# EasyEDA schematic 1-Schematic_NotKia 168x.json

## Sheets
1 Core: TITLE: Notkia Core; REV: 2.0; Date: 2022-04-26; Sheet: 1/12; Drawn By: re1mu; Company: SudoMaker
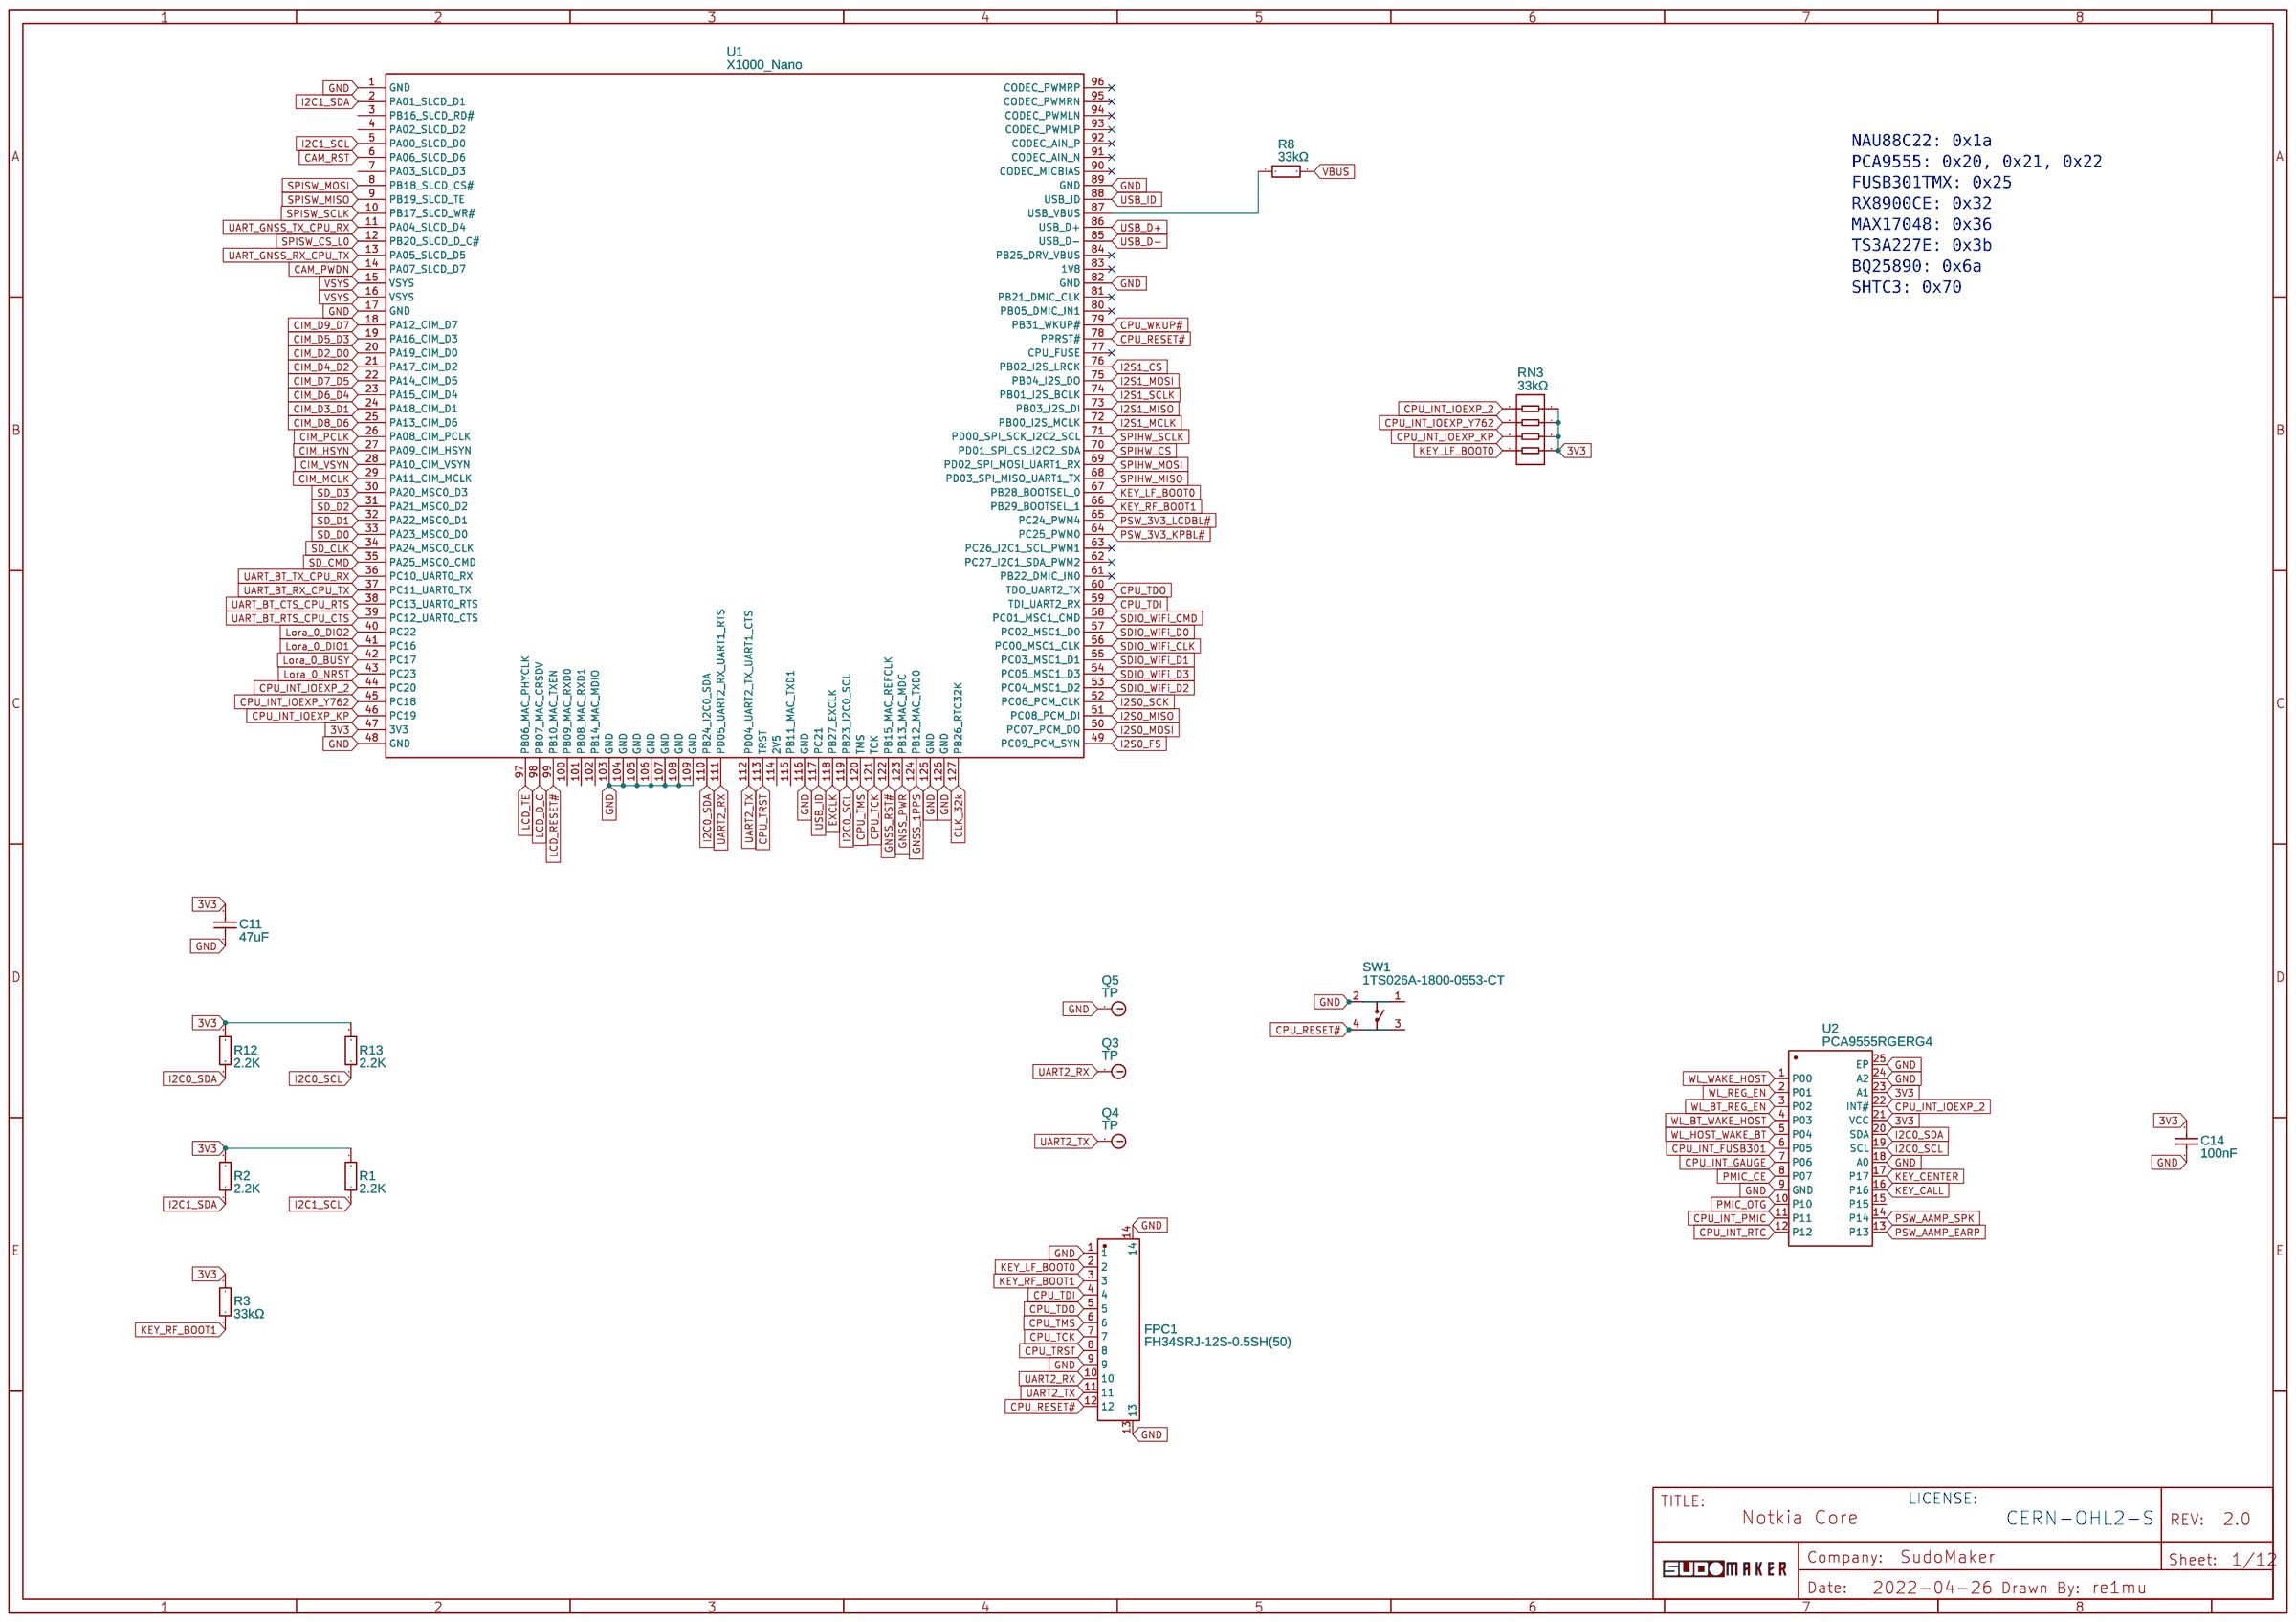
[diagram p0: Core]
2 Camera: TITLE: Notkia Camera; Date: 2022-05-16; Sheet: 2/12
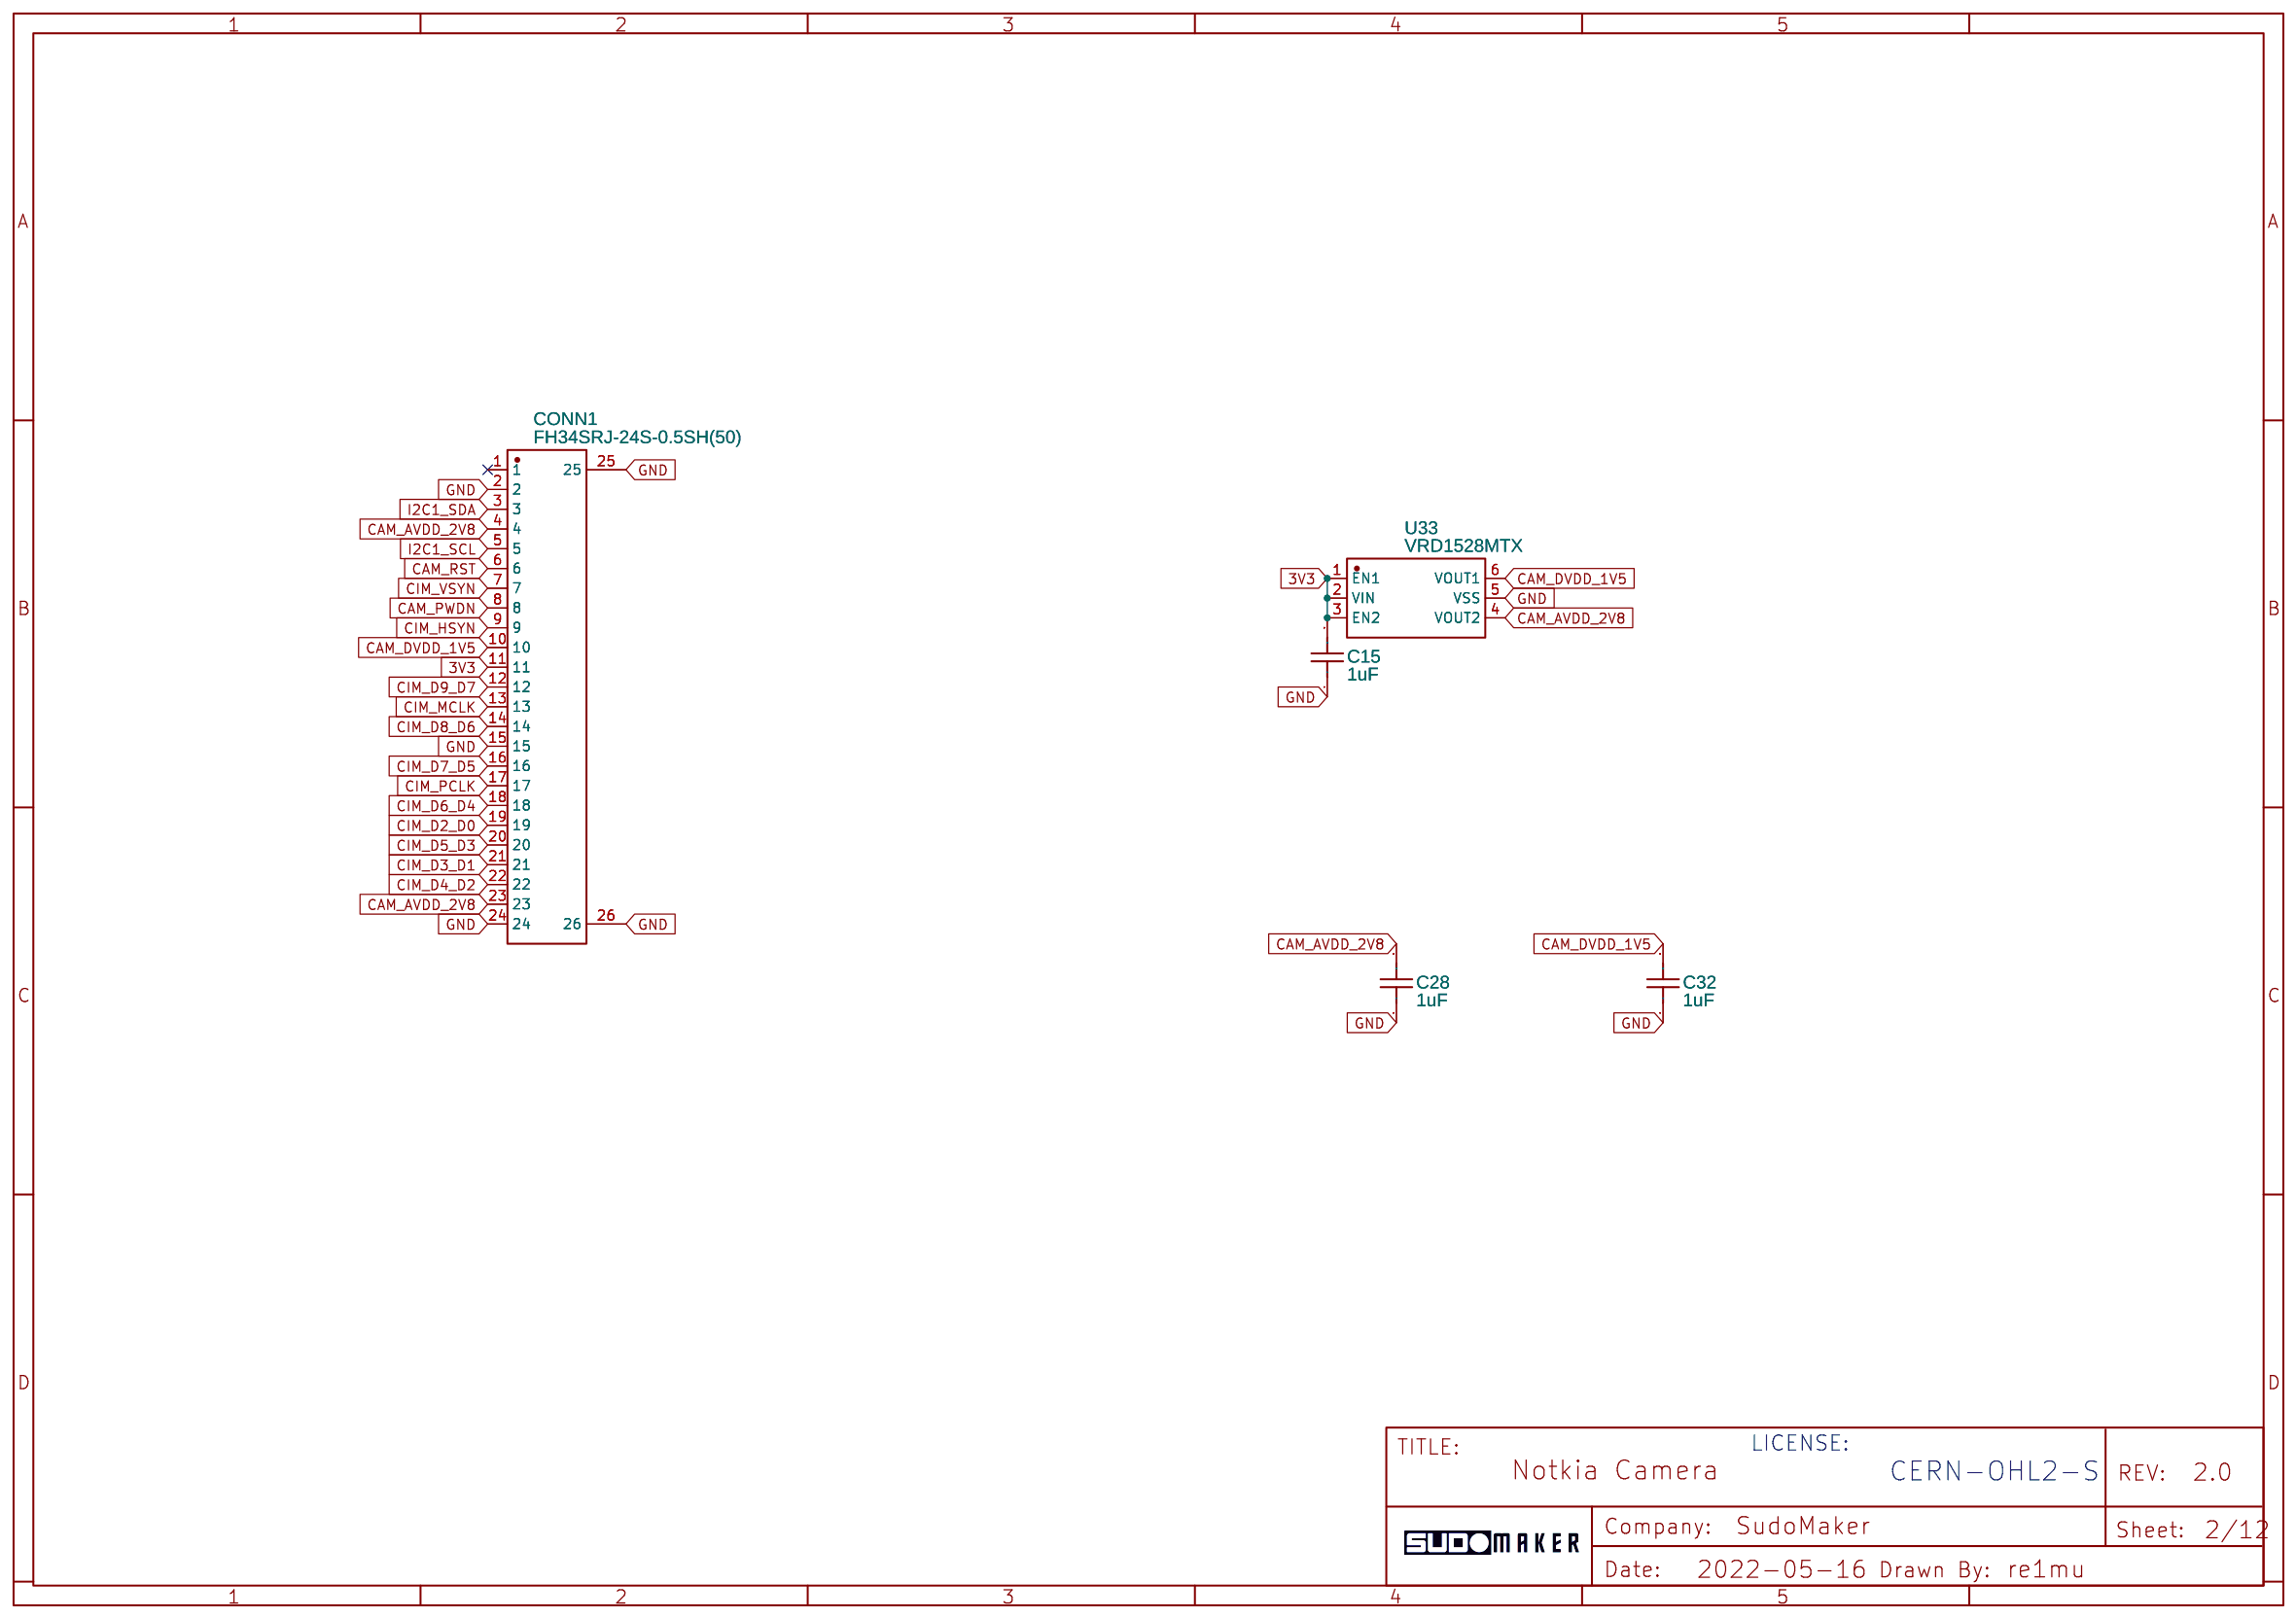
[diagram p1: Camera]
3 USB: TITLE: Notkia USB; Sheet: 3/12
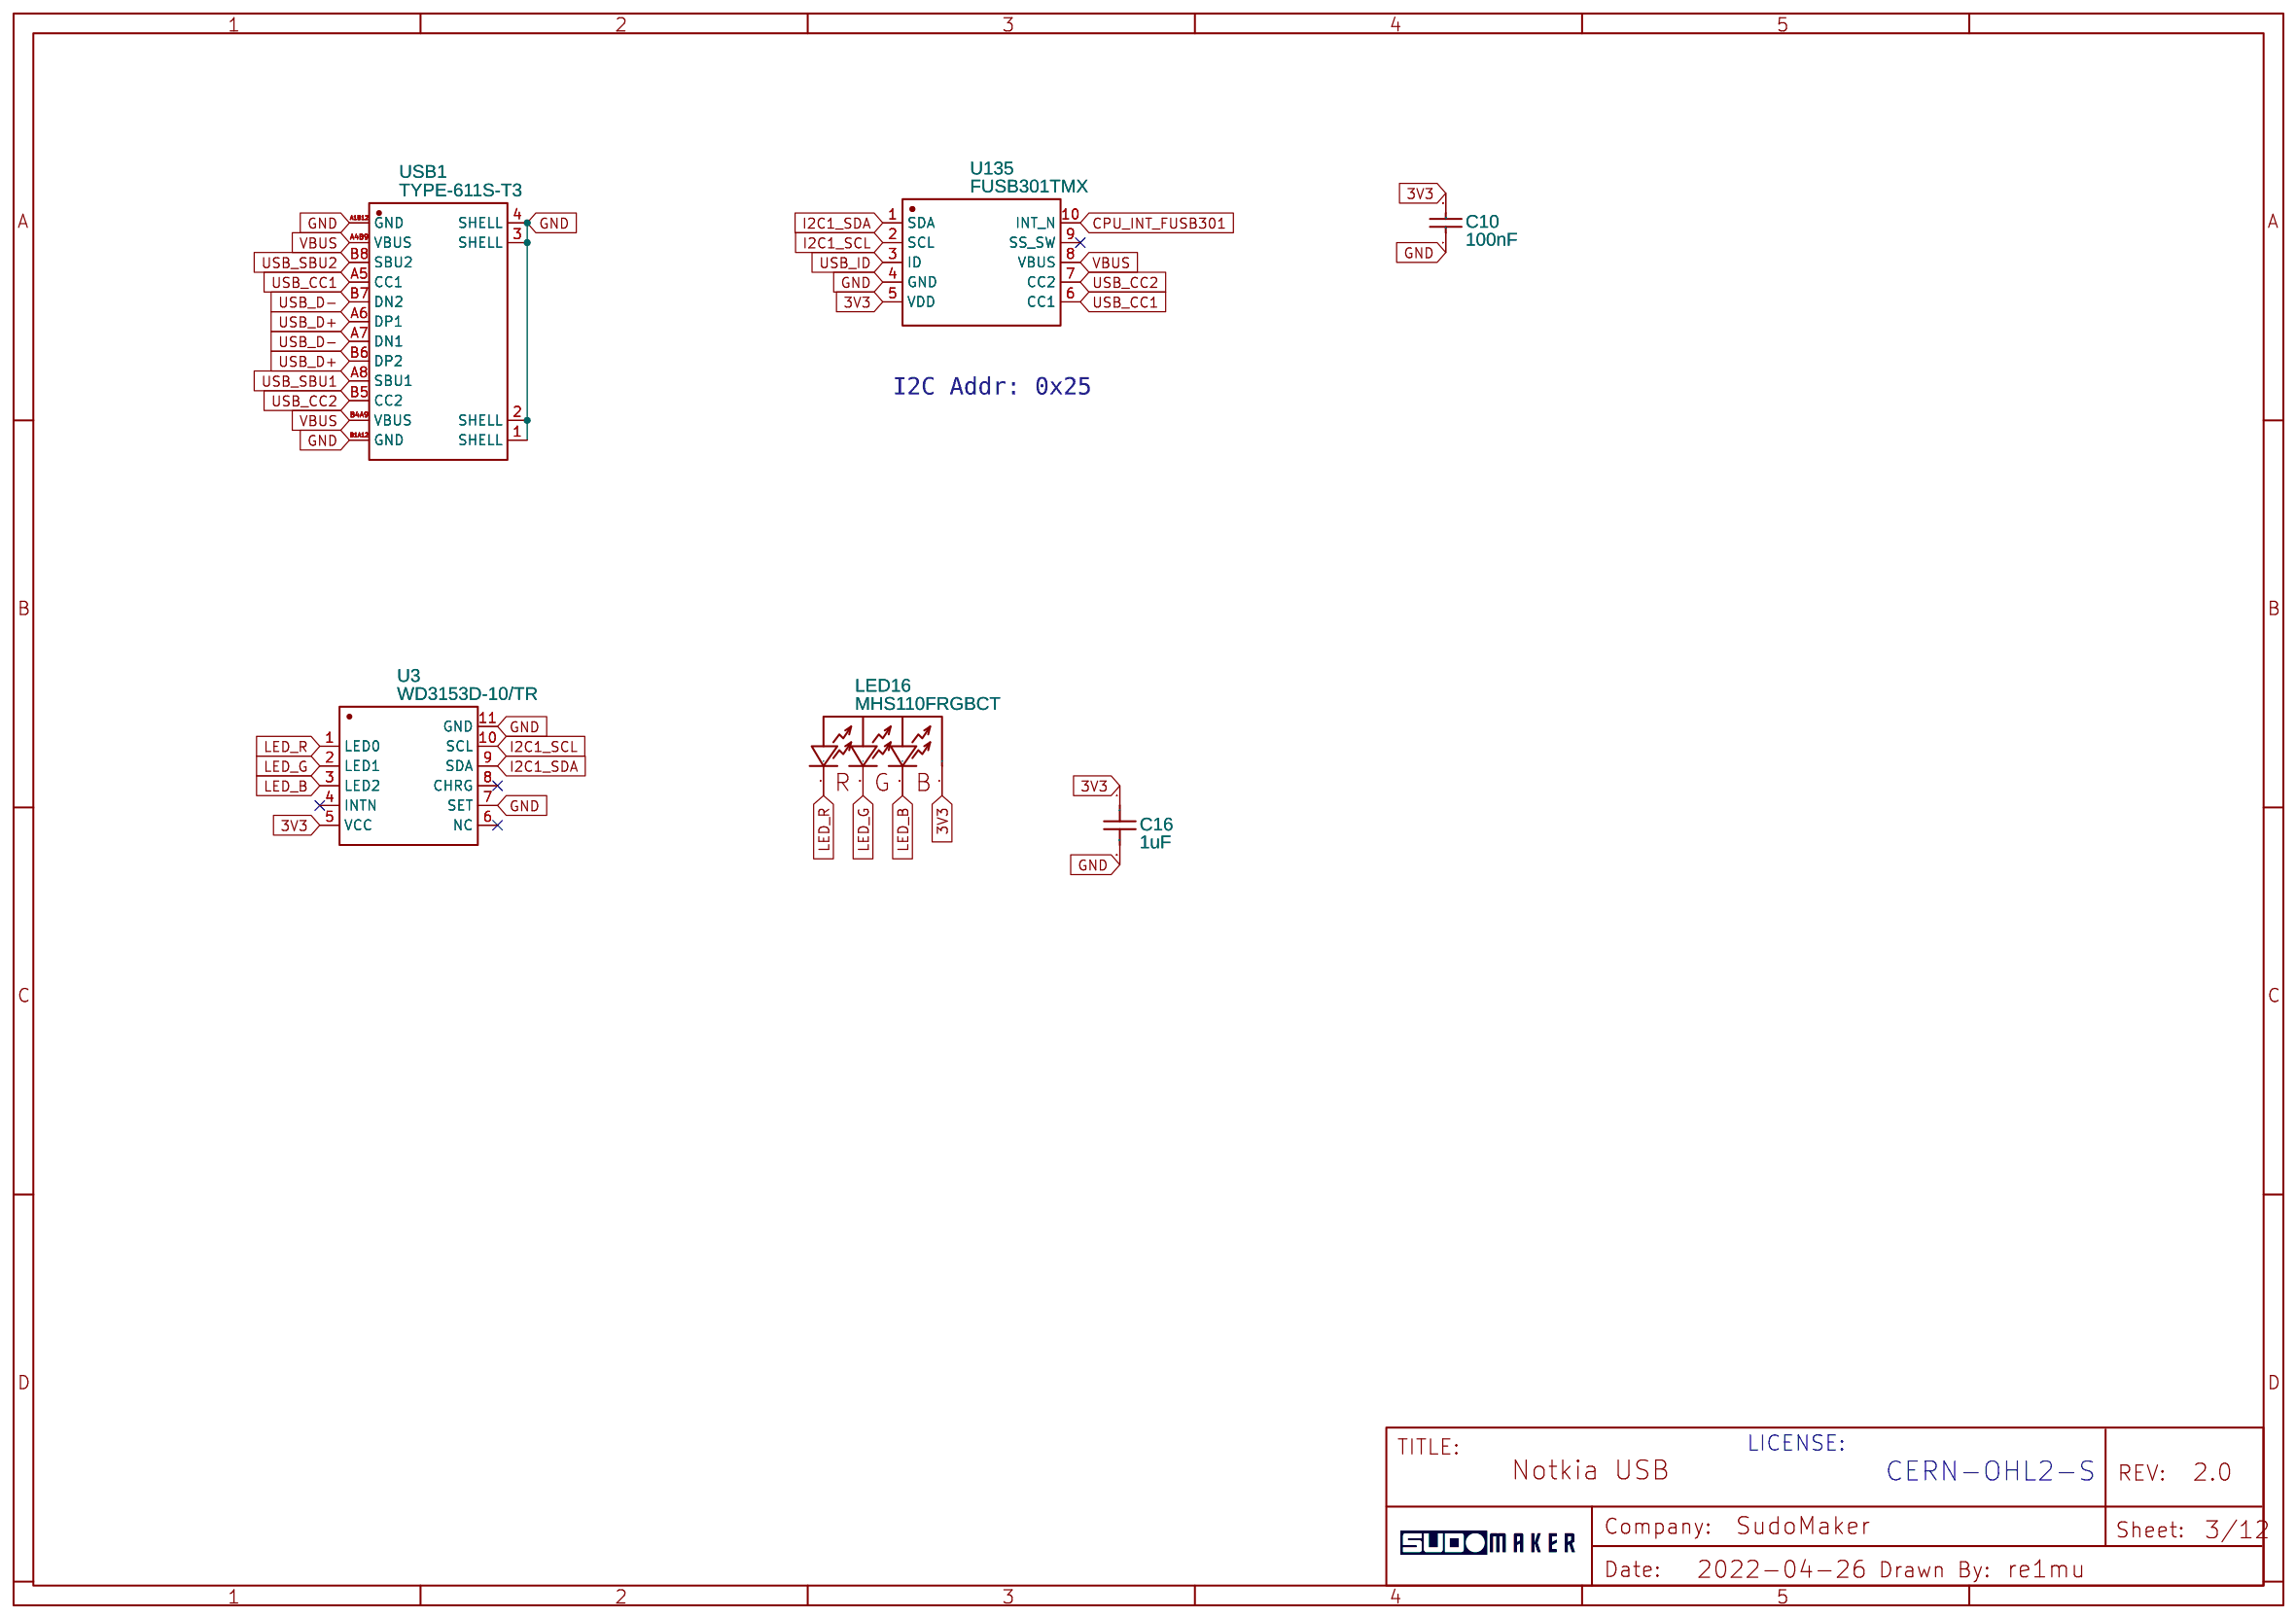
[diagram p2: USB]
4 Audio: TITLE: Notkia Audio; Sheet: 4/12
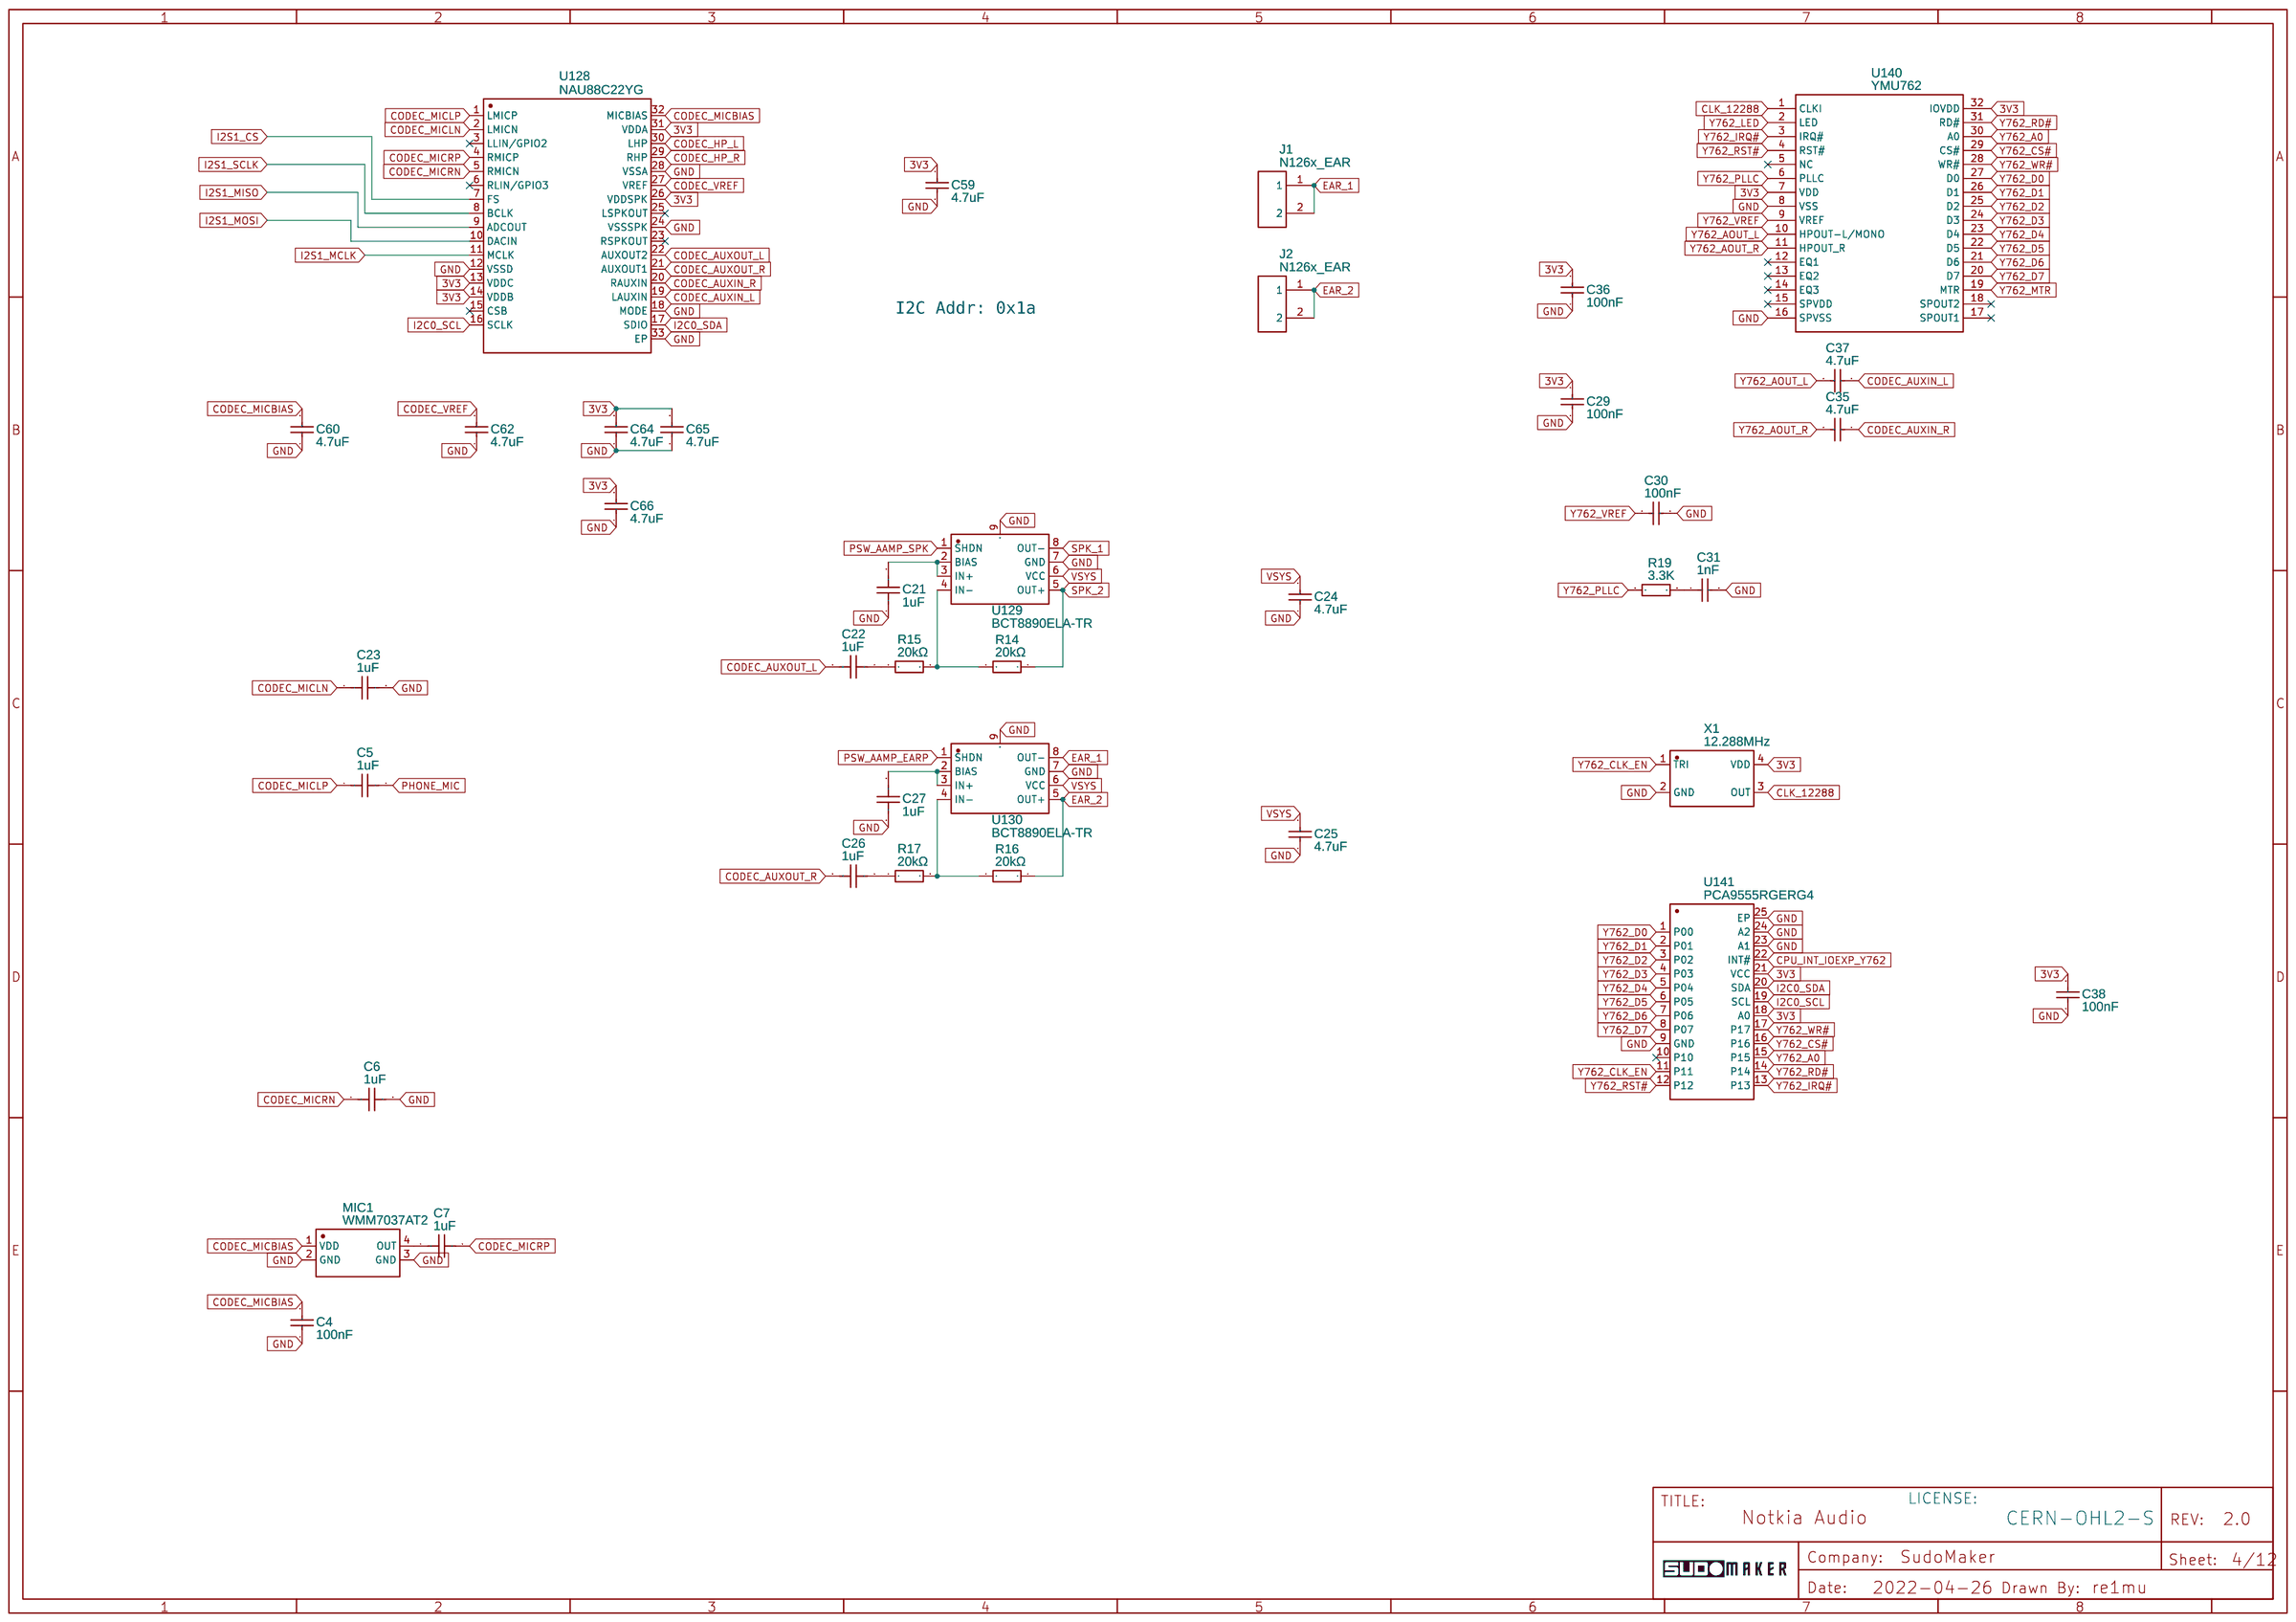
[diagram p3: Audio]
5 RF_Sub1G: TITLE: Notkia RF_Sub1G; Sheet: 6/12
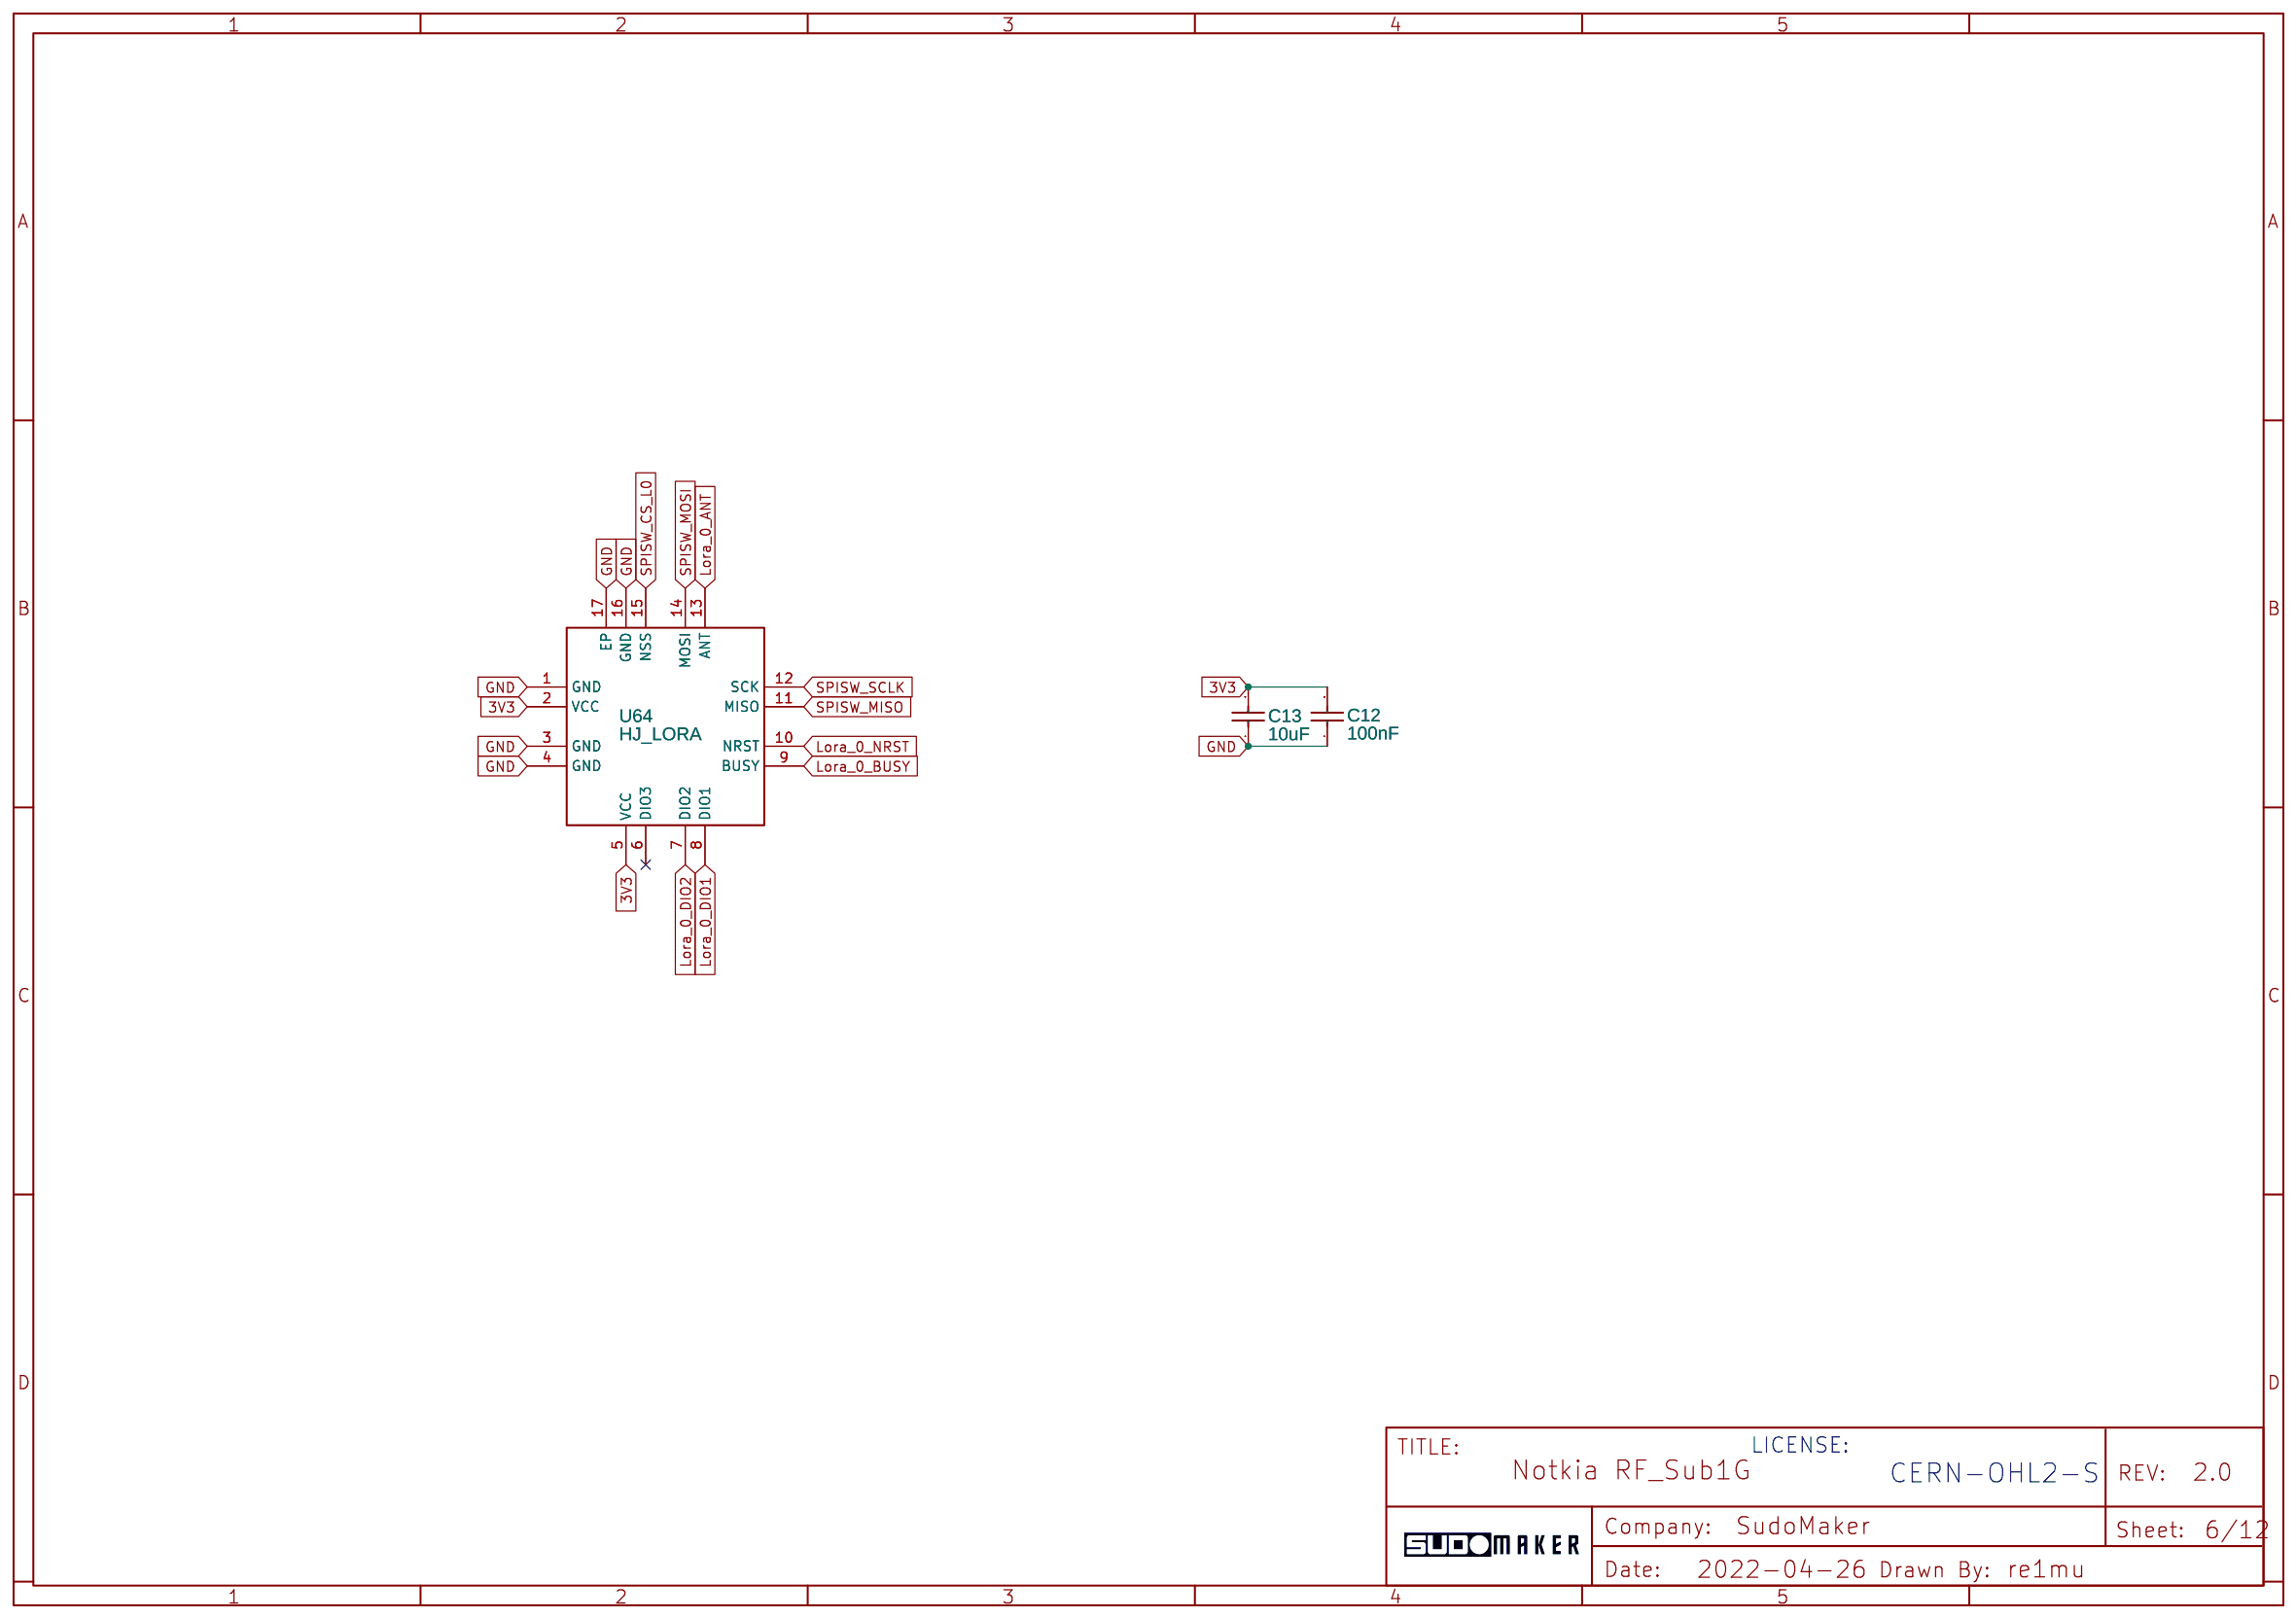
[diagram p4: RF_Sub1G]
6 RF_GNSS: TITLE: Notkia RF_GNSS; Sheet: 7/12
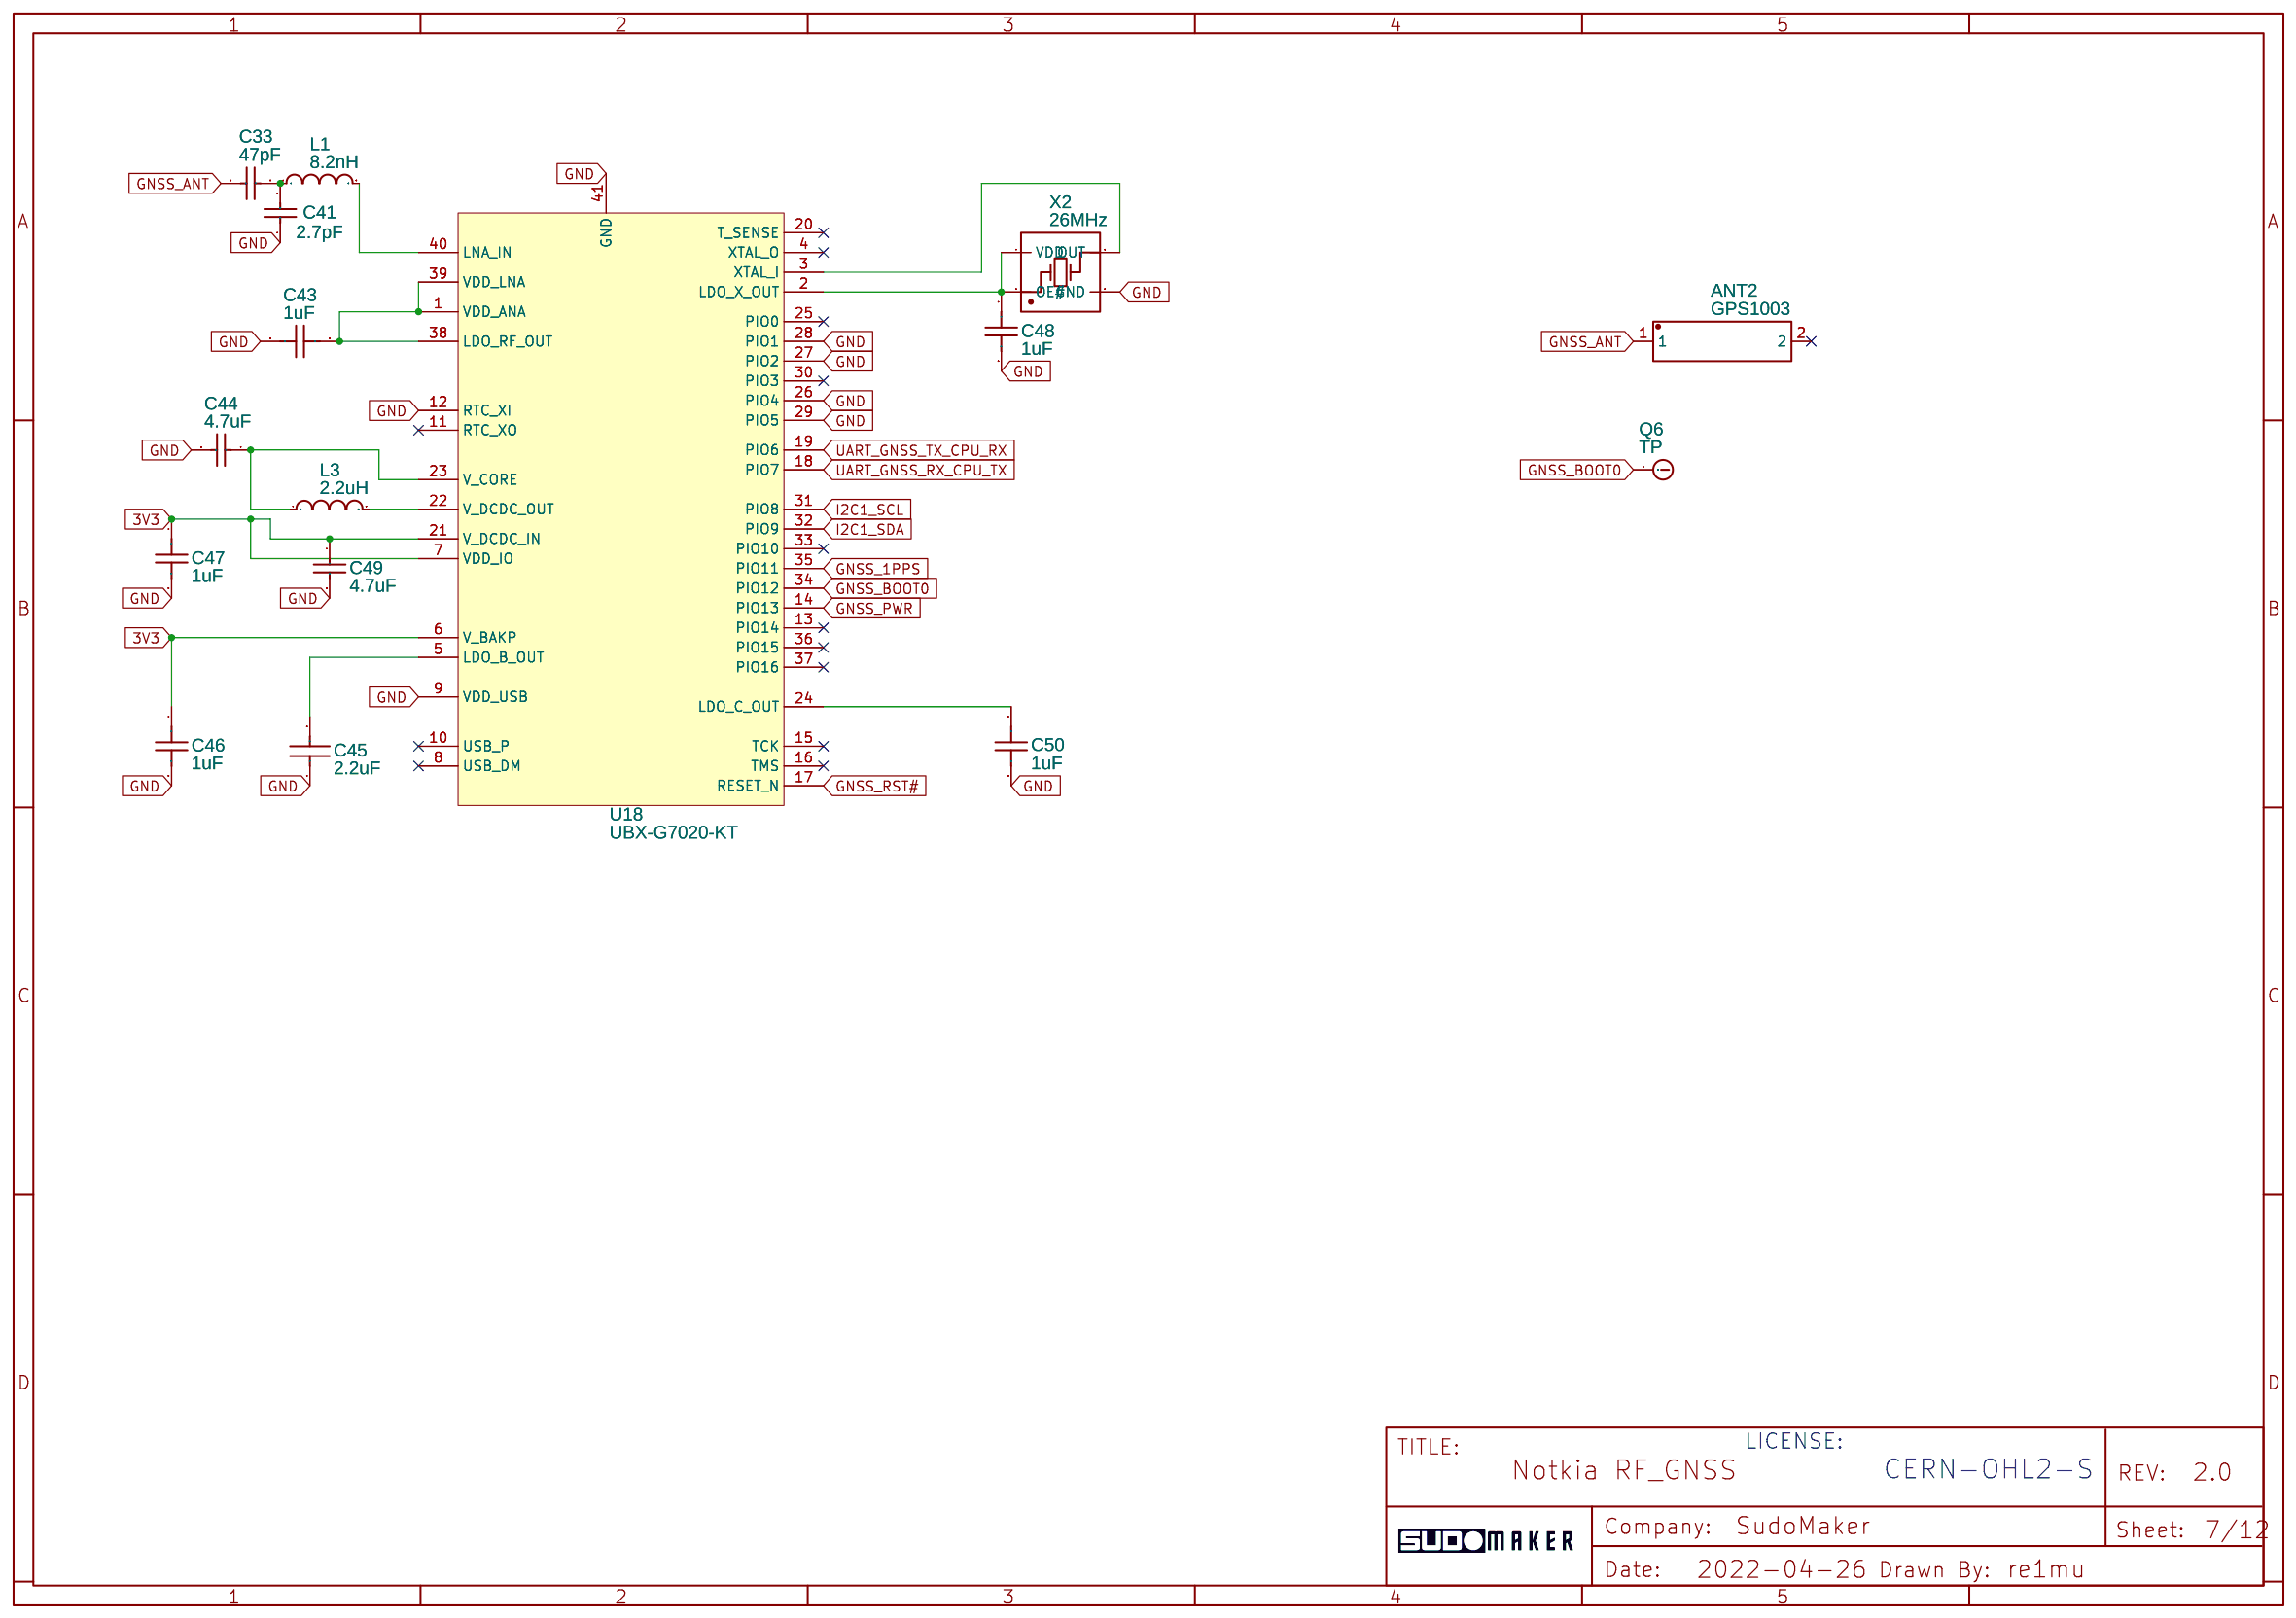
[diagram p5: RF_GNSS]
7 Power: TITLE: Notkia Power; Sheet: 8/12
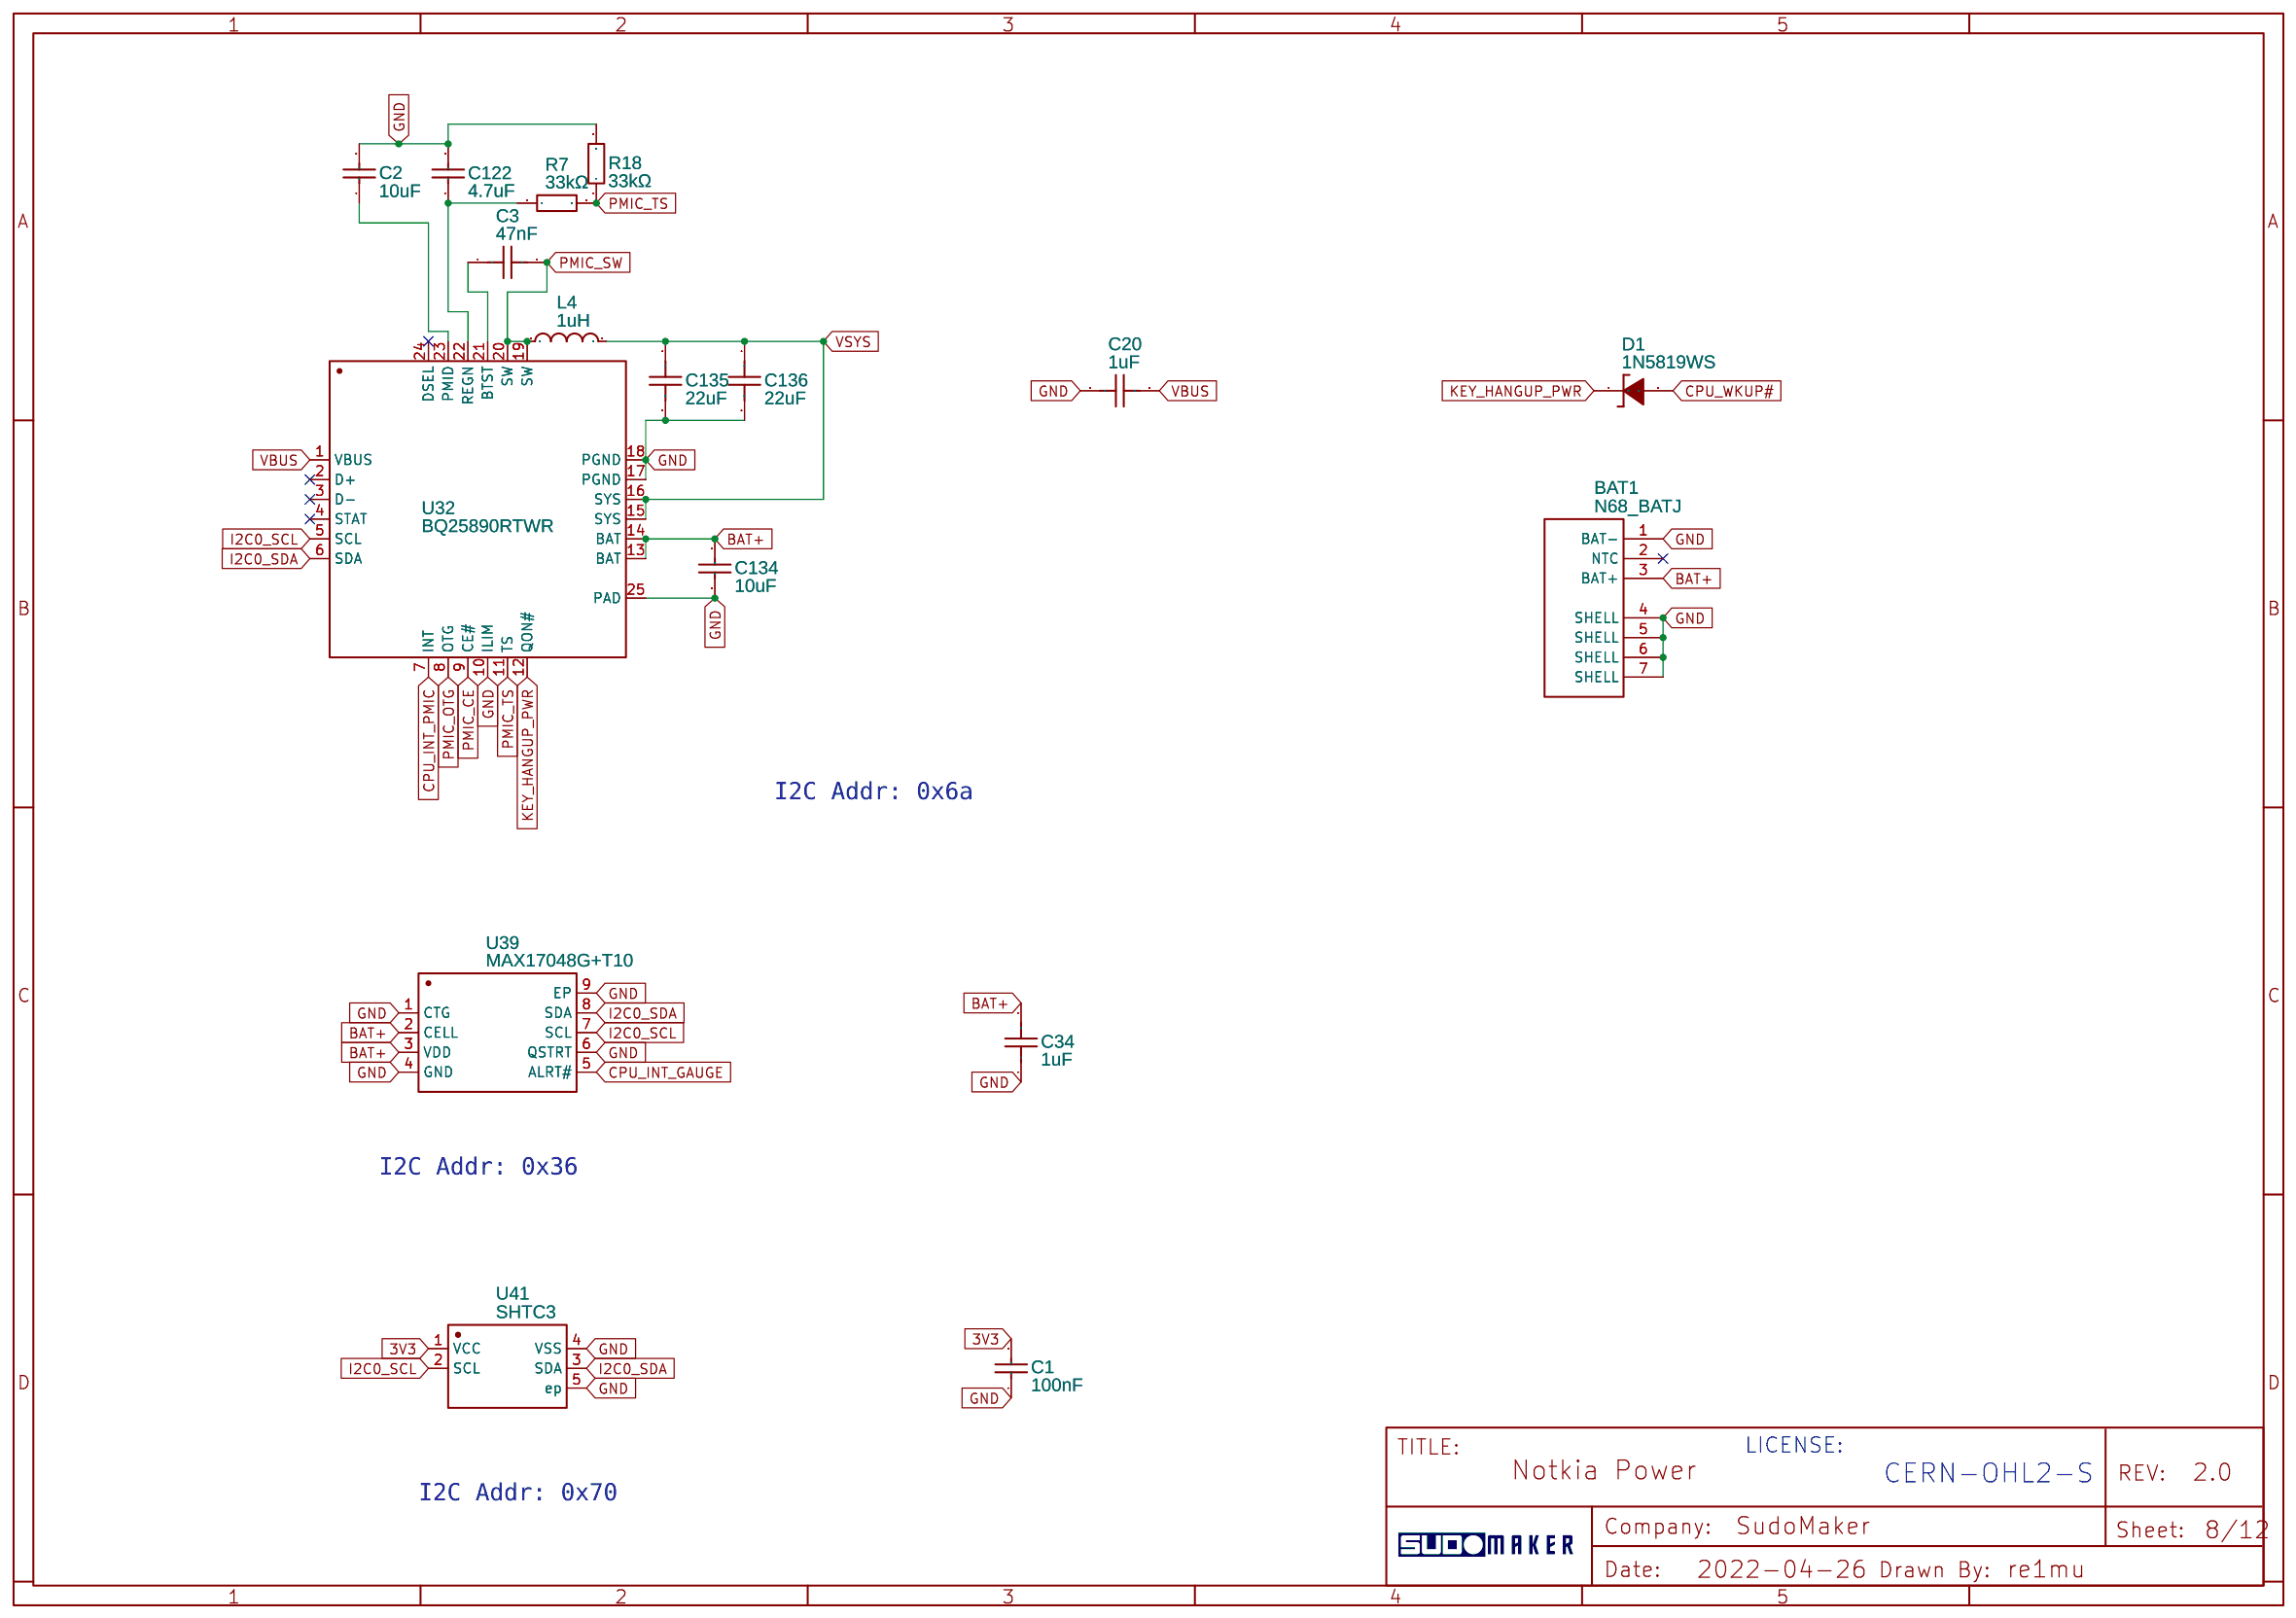
[diagram p6: Power]
8 W1F1: TITLE: Notkia WiFi; Sheet: 9/12
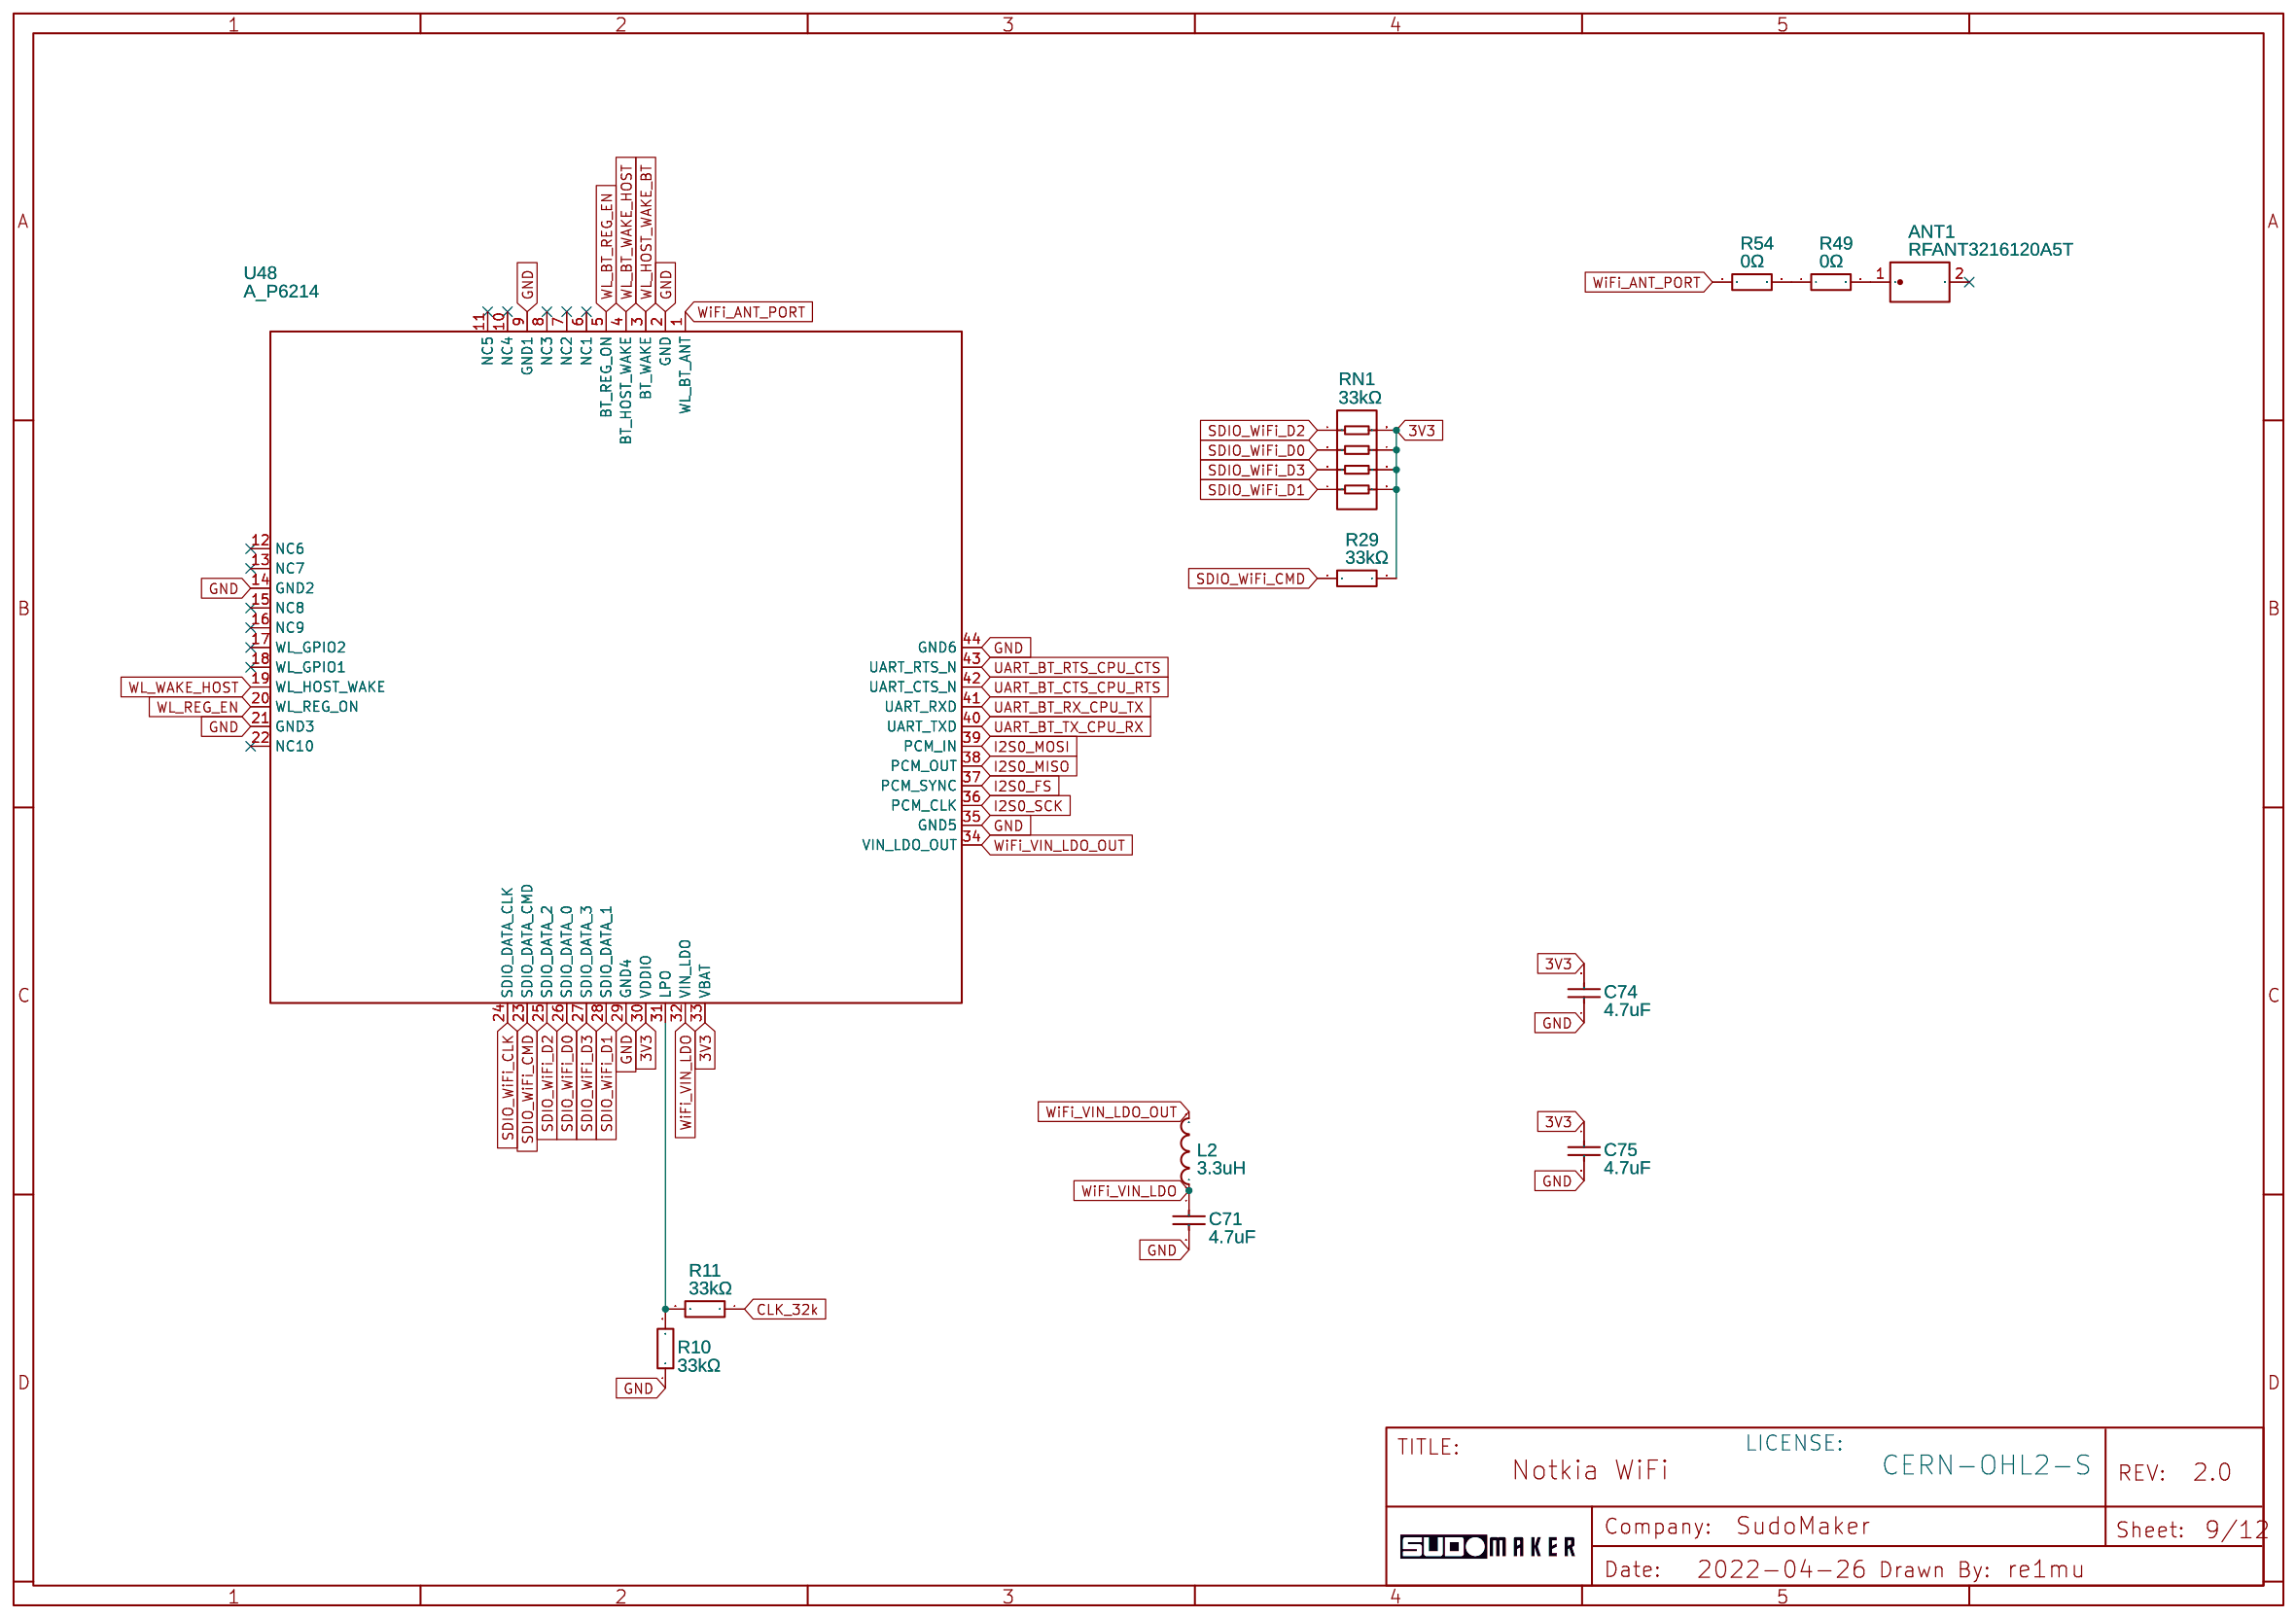
[diagram p7: W1F1]
9 Keypad: TITLE: Notkia Keypad; Date: 2022-04-27; Sheet: 10/12
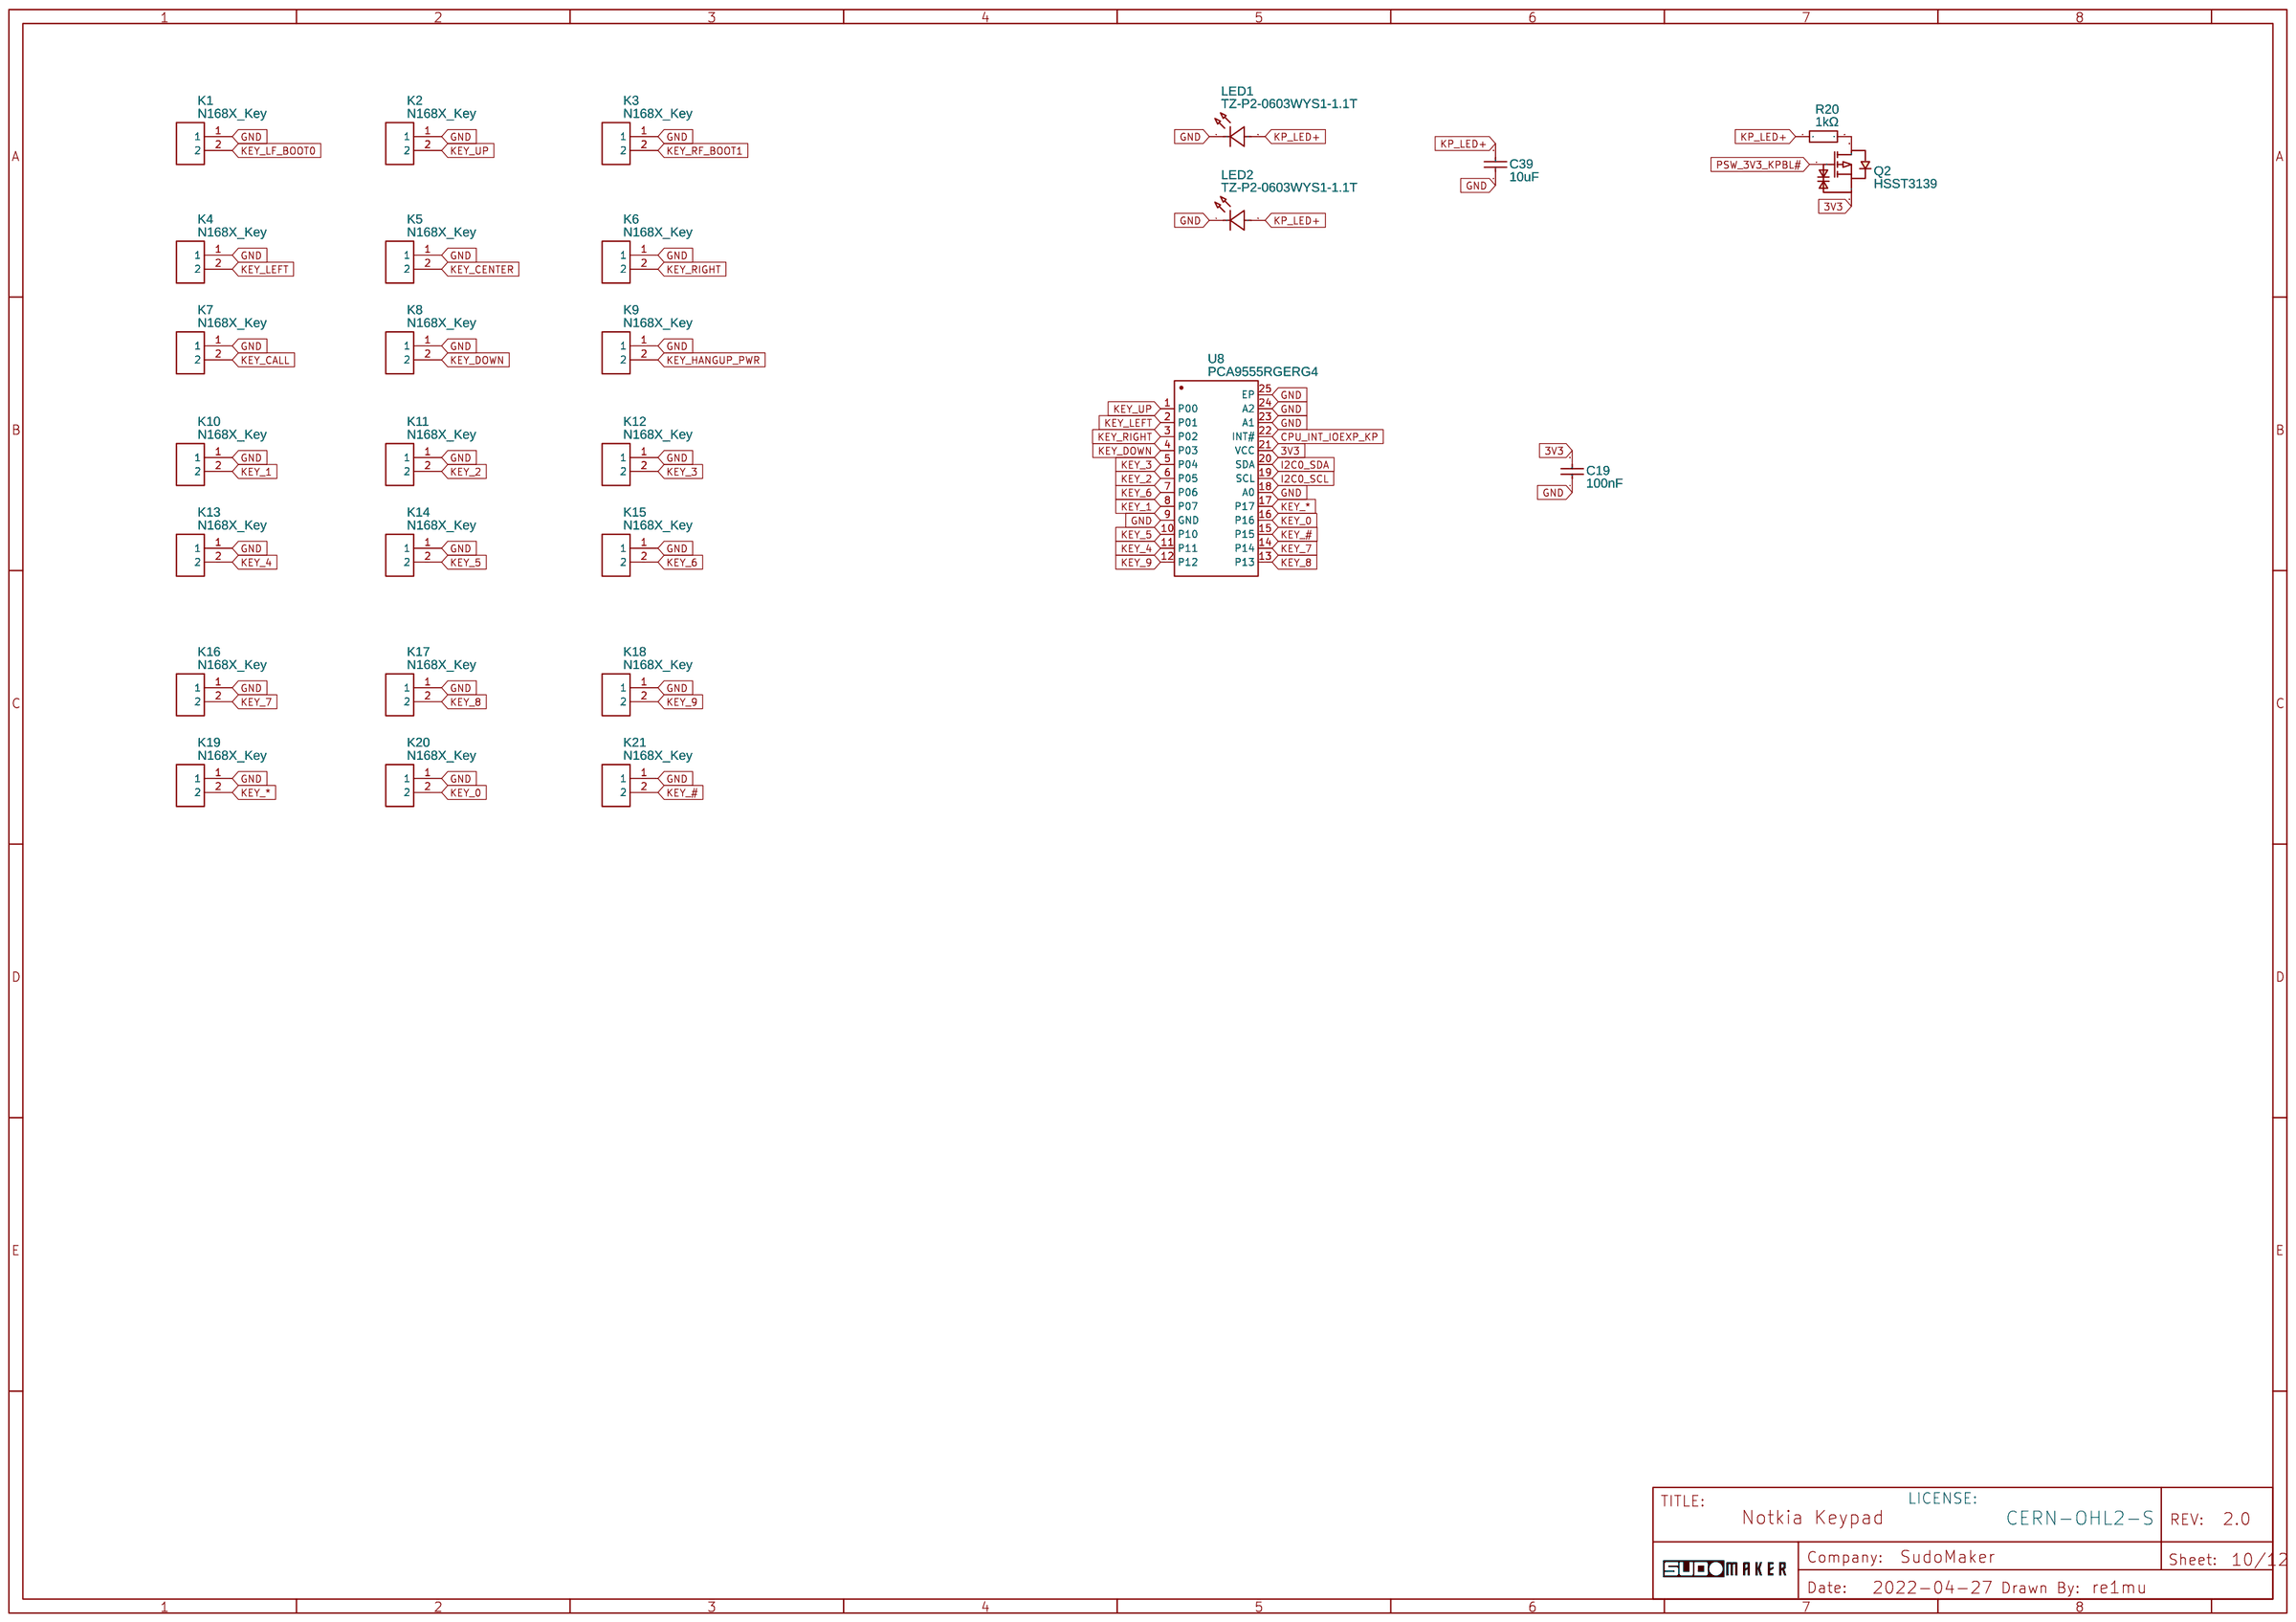
[diagram p8: Keypad]
10 Storage: TITLE: Notkia Storage; Date: 2022-04-28; Sheet: 11/12
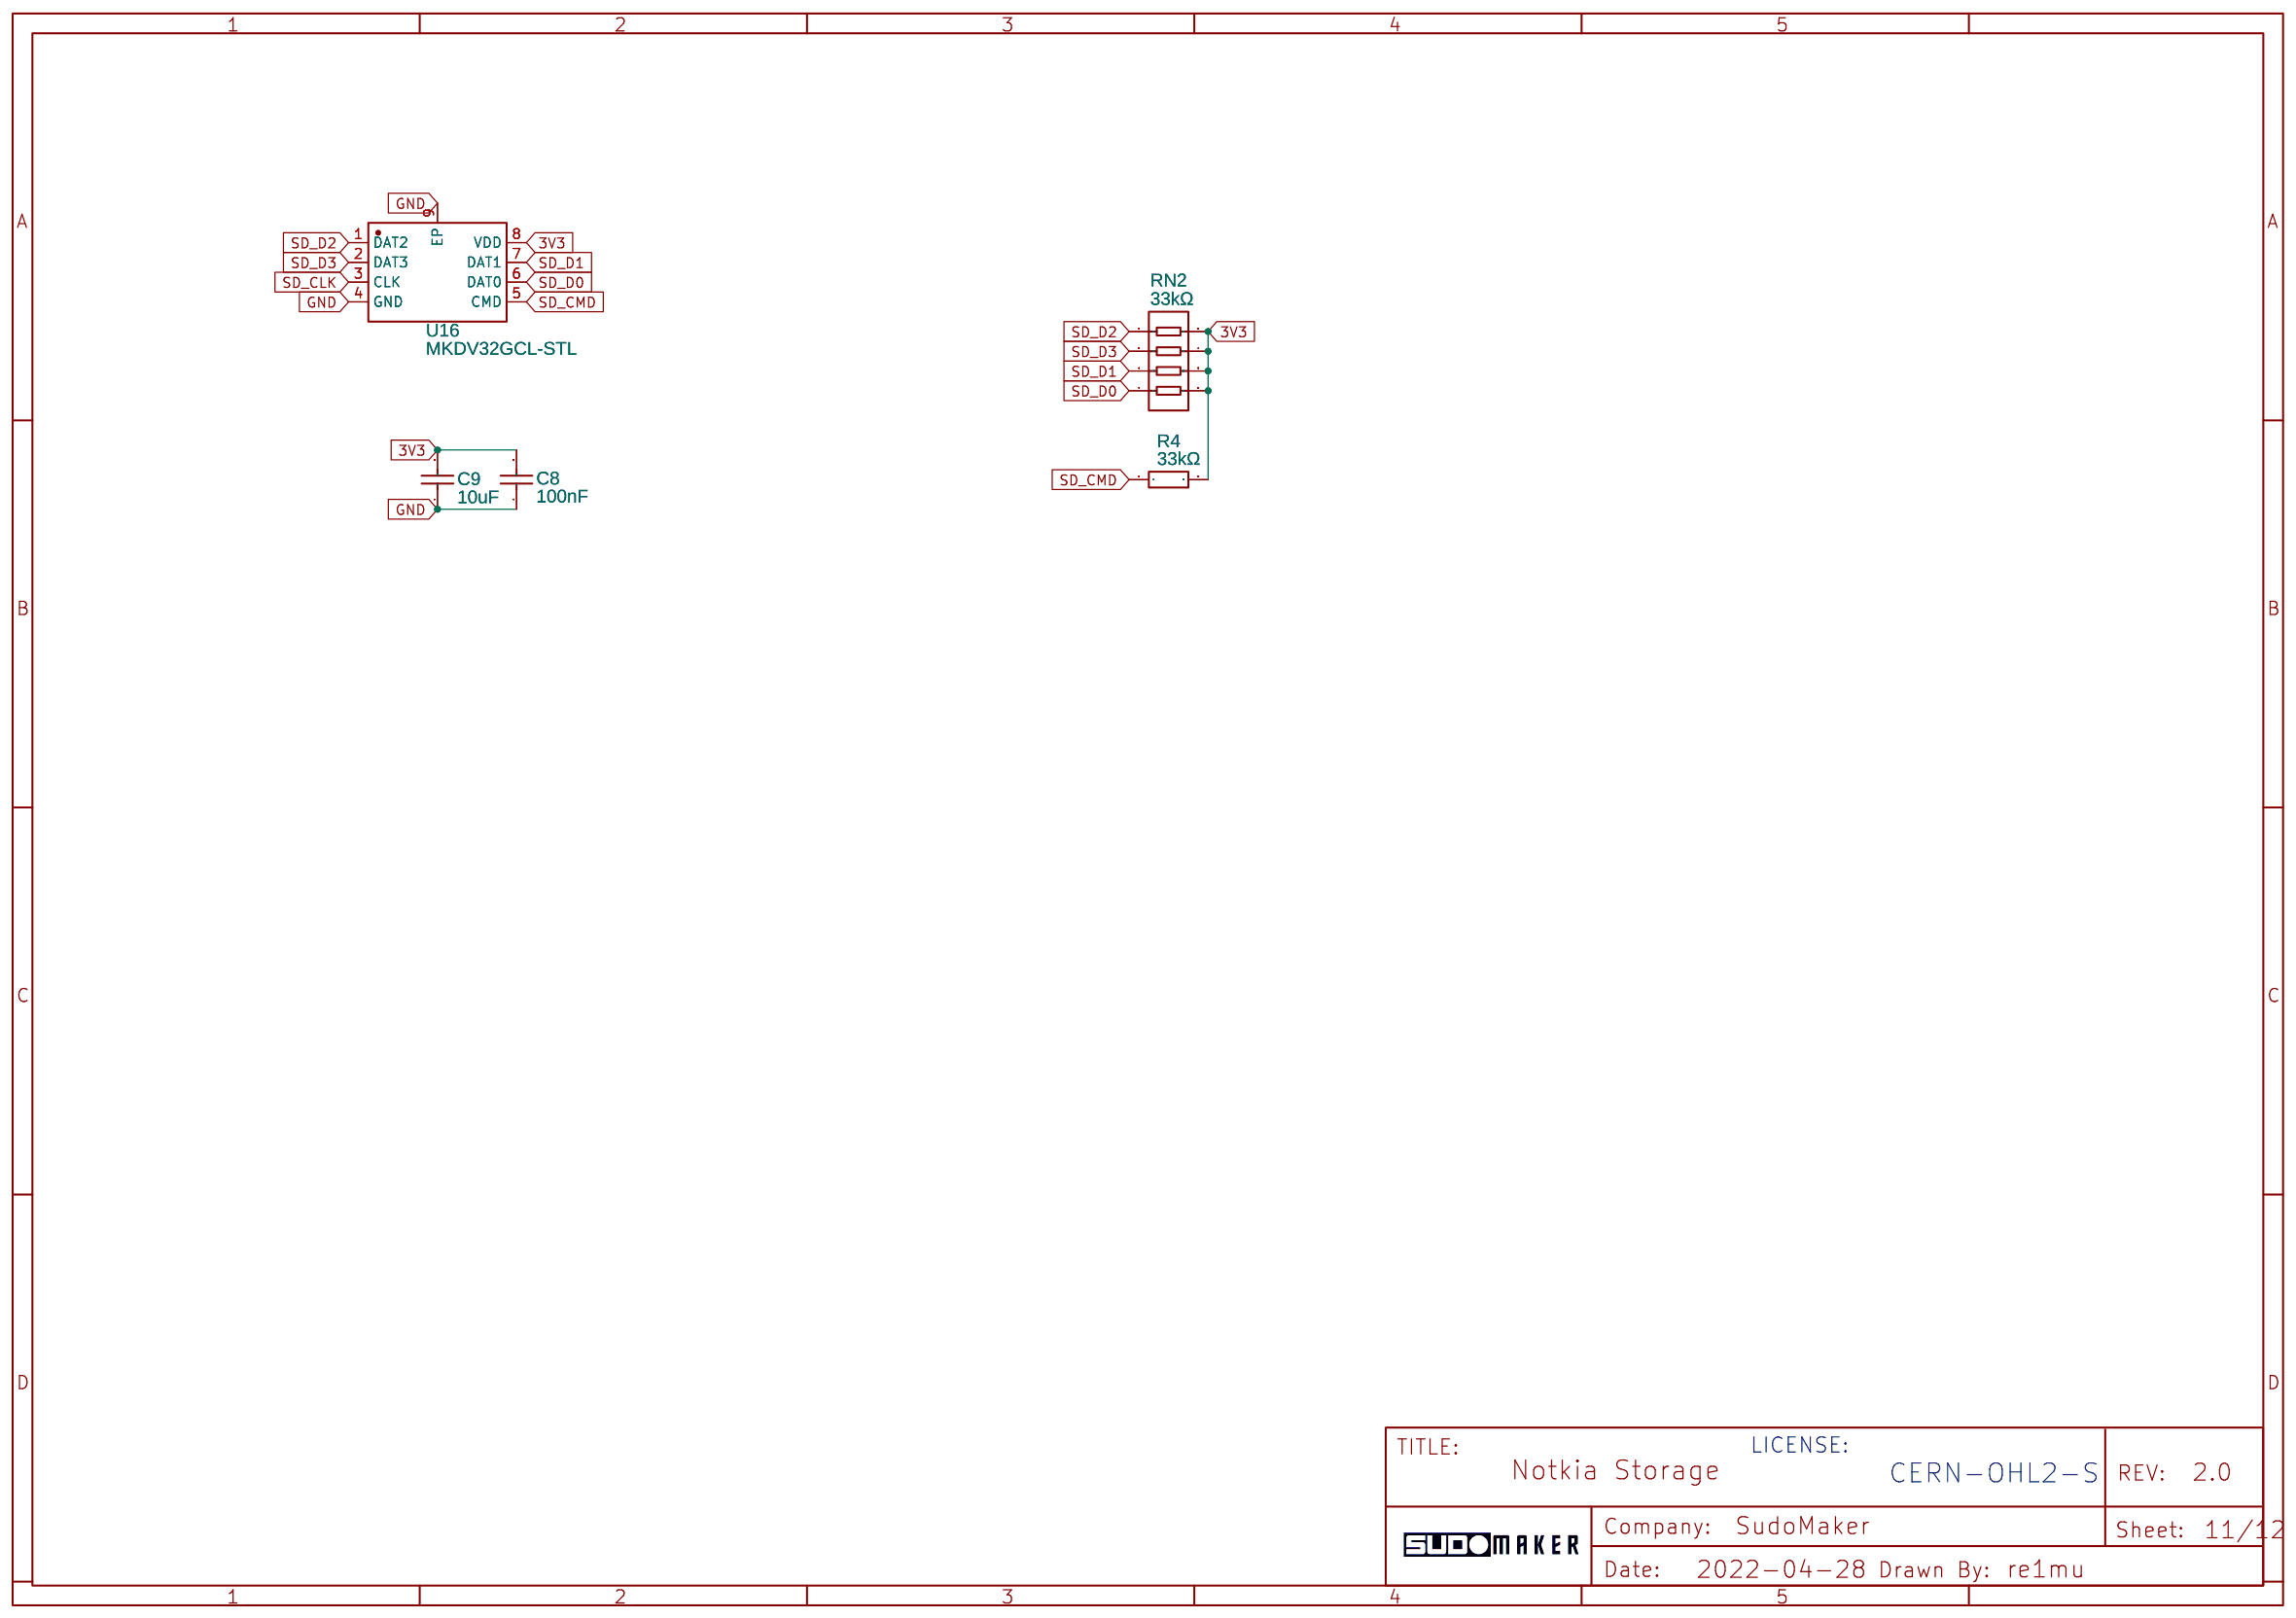
[diagram p9: Storage]
11 Display: TITLE: Notkia Display; Date: 2022-04-29; Sheet: 12/12
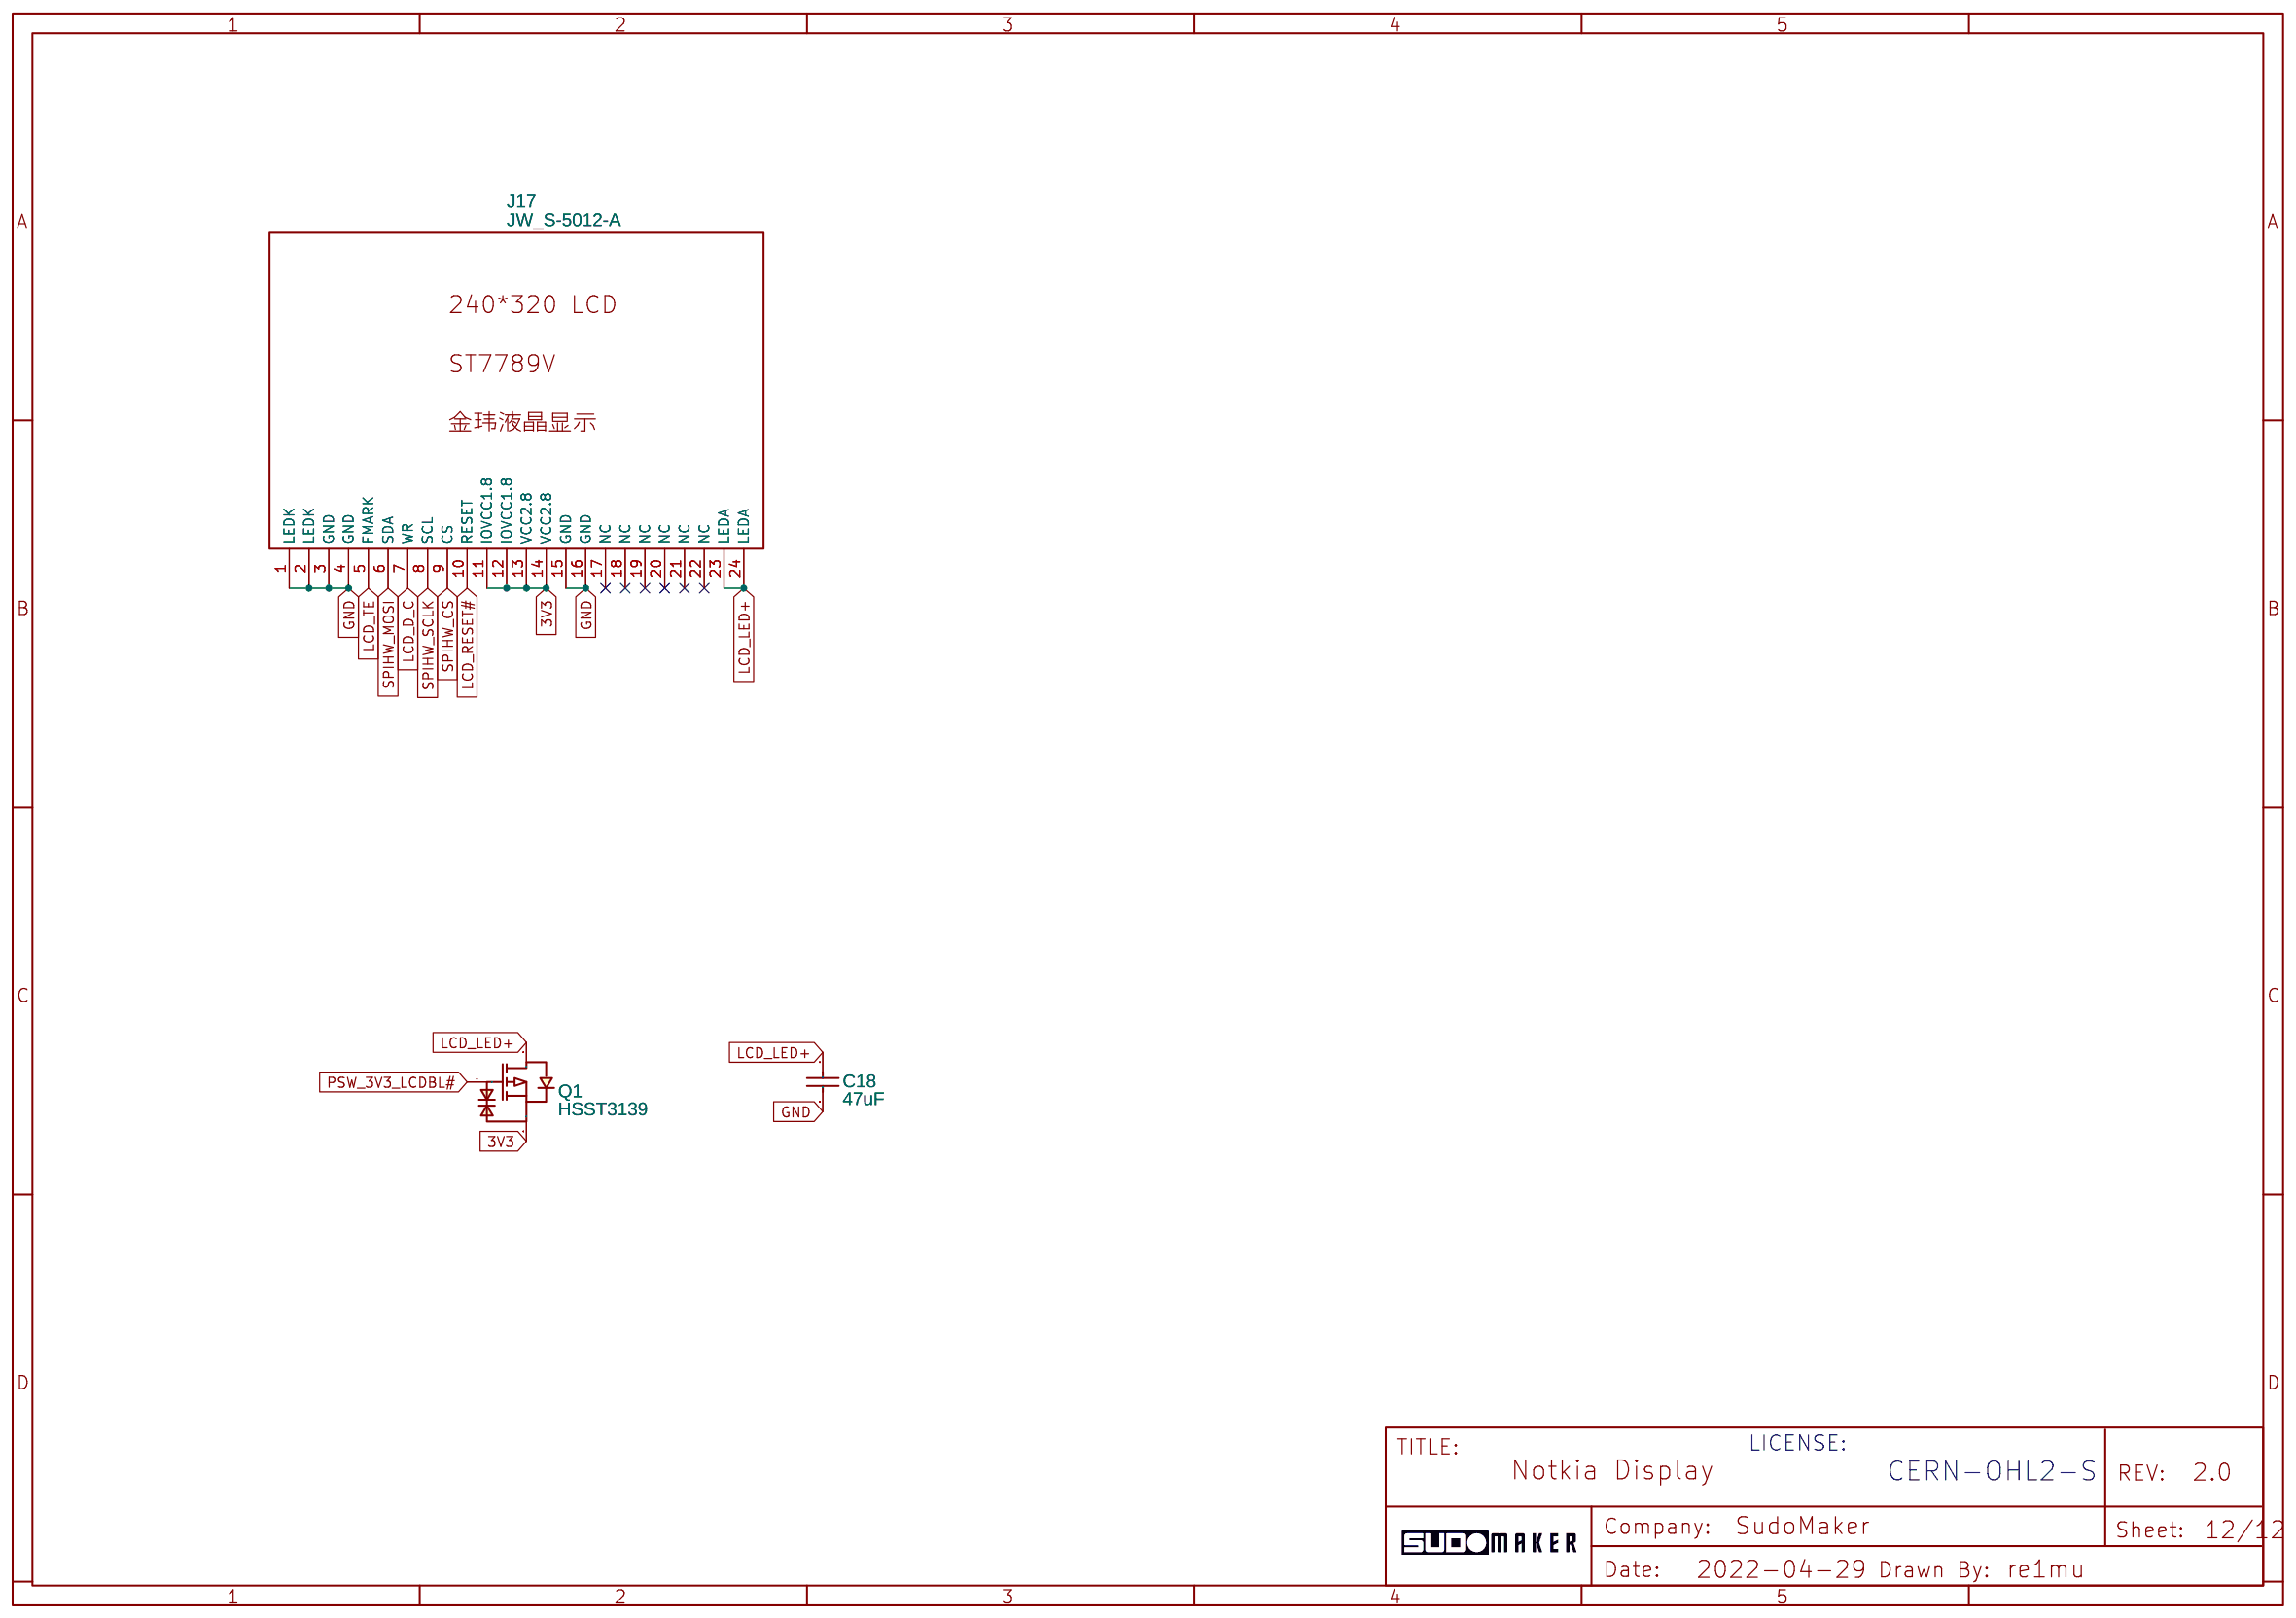
[diagram p10: Display]
12 RTC: TITLE: Notkia RTC; Date: 2022-06-04; Sheet: 5/12
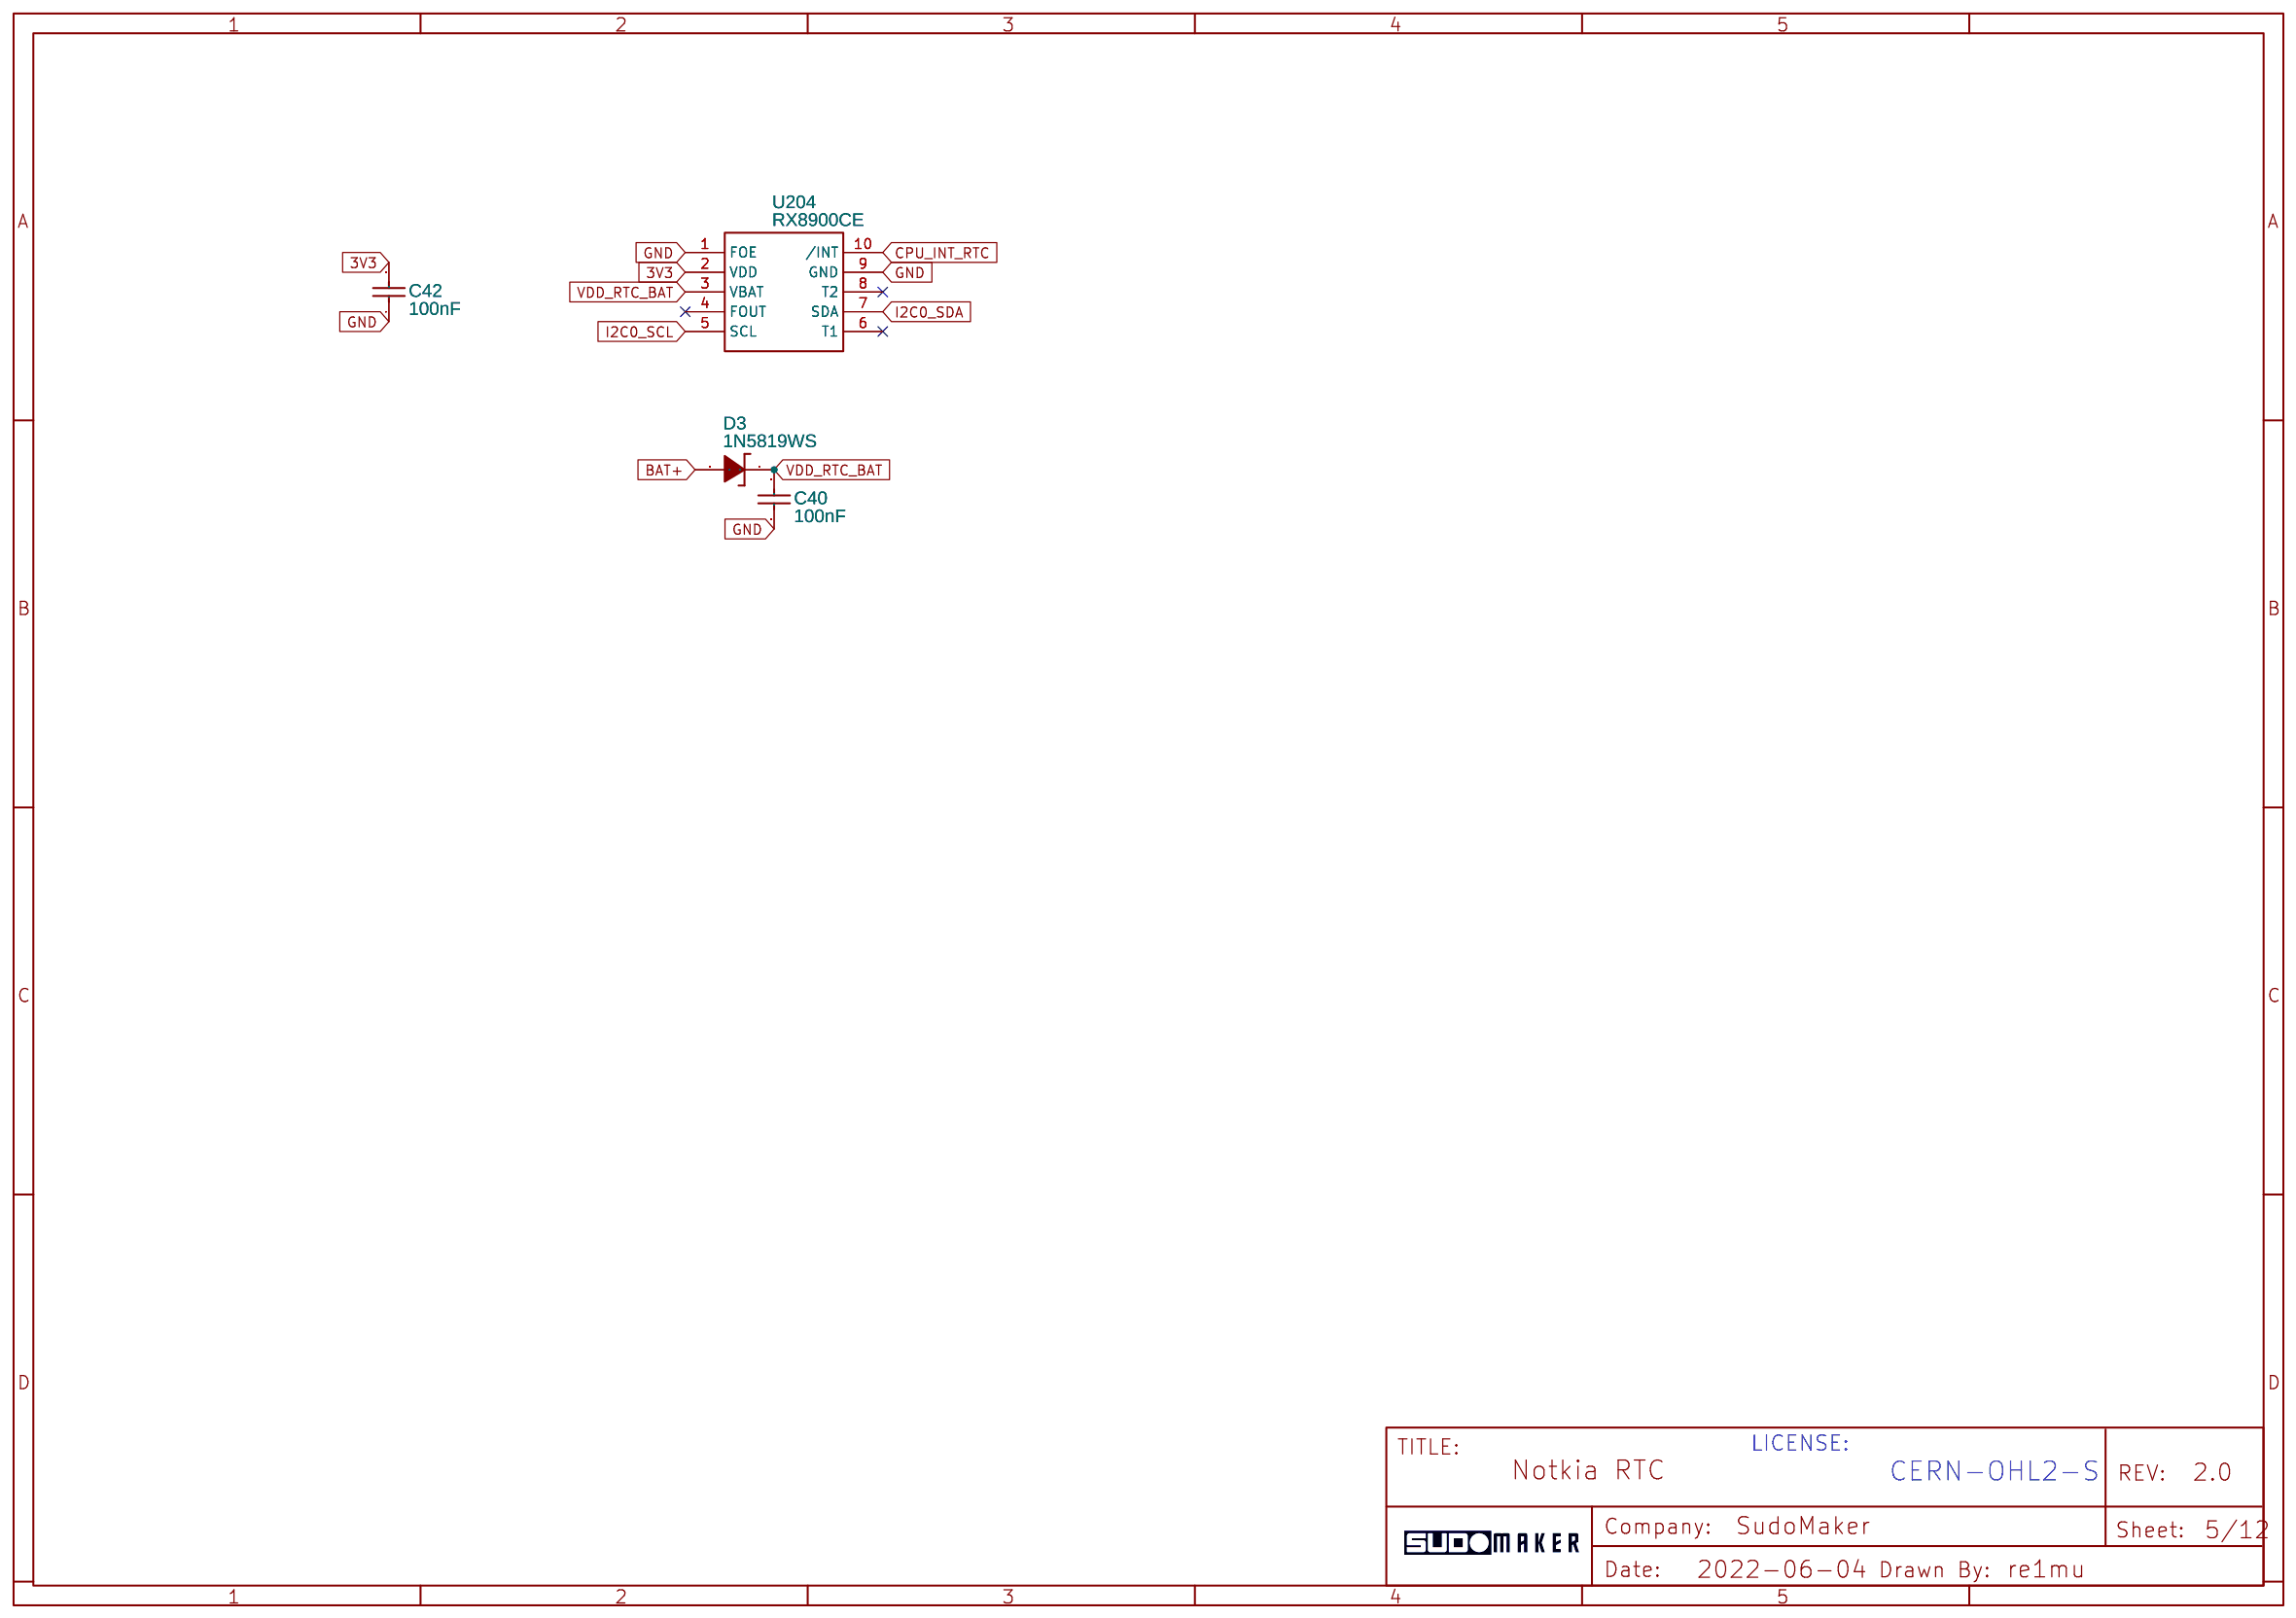
[diagram p11: RTC]

## Parts
sheet Audio
C4  100nF  [C0402_NEW]
C5  1uF  [C0402]
C6  1uF  [C0402]
C7  1uF  [C0402]
C21  1uF  [C0402]
C22  1uF  [C0402]
C23  1uF  [C0402]
C24  4.7uF  [C0402]
C25  4.7uF  [C0402]
C26  1uF  [C0402]
C27  1uF  [C0402]
C29  100nF  [C0402]
C30  100nF  [C0402]
C31  1nF  [C0402]
C35  4.7uF  [C0402]
C36  100nF  [C0402]
C37  4.7uF  [C0402]
C38  100nF  [C0402_NEW]
C59  4.7uF  [C0402]
C60  4.7uF  [C0402]
C62  4.7uF  [C0402]
C64  4.7uF  [C0402]
C65  4.7uF  [C0402]
C66  4.7uF  [C0402]
J1  N126x_EAR  [N126X_EAR]
J2  N126x_EAR  [N126X_EAR]
MIC1  WMM7037AT2  [MIC-SMD_L3.8-W3.00-TL]
R14  20kΩ  [R0402]
R15  20kΩ  [R0402]
R16  20kΩ  [R0402]
R17  20kΩ  [R0402]
R19  3.3K  [R0402]
U128  NAU88C22YG  [QFN-32_L5.0-W5.0-P0.50-BL-EP3.4]
U129  BCT8890ELA-TR  [DFN-8_L2.0-W2.0-P0.50-BL-EP-1]
U130  BCT8890ELA-TR  [DFN-8_L2.0-W2.0-P0.50-BL-EP-1]
U140  YMU762  [C-PK32QP-2]
U141  PCA9555RGERG4  [VQFN-24_L4.0-W4.0-P0.50-TL-EP2.4]
X1  12.288MHz  [OSC-SMD_4P-L2.0-W1.6-BL_SIT1602BI]
sheet Camera
C15  1uF  [C0402]
C28  1uF  [C0402]
C32  1uF  [C0402]
CONN1  FH34SRJ-24S-0.5SH(50)  [FFC-SMD_24P-P0.50_FH34SRJ-24S-0.5SH]
U33  VRD1528MTX  [SOT-23-6_L2.9-W1.6-P0.95-LS2.8-BL]
sheet Core
C11  47uF  [C0805]
C14  100nF  [C0402_NEW]
FPC1  FH34SRJ-12S-0.5SH(50)  [FFC-SMD_12P-P0.50_FH34SRJ-12S-0.5SH]
Q3  TP  [TP]
Q4  TP  [TP]
Q5  TP  [TP]
R1  2.2K  [R0402]
R2  2.2K  [R0402]
R3  33kΩ  [R0402]
R8  33kΩ  [R0402]
R12  2.2K  [R0402]
R13  2.2K  [R0402]
RN3  33kΩ  [RES-ARRAY-SMD_0402-8P-L2.0-W1.0-BL]
SW1  1TS026A-1800-0553-CT  [SW-SMD_4P-L2.6-W1.6-P0.75-LS3.0]
U1  X1000_Nano  [X1000_NANO]
U2  PCA9555RGERG4  [VQFN-24_L4.0-W4.0-P0.50-TL-EP2.4]
sheet Display
C18  47uF  [C0805]
J17  JW_S-5012-A  [JW_S-5012-A]
Q1  HSST3139  [SOT-523-3_L1.6-W0.8-P1.00-LS1.6-BR]
sheet Keypad
C19  100nF  [C0402_NEW]
C39  10uF  [C0402]
K1  N168X_Key  [N168X_KEY]
K2  N168X_Key  [N168X_KEY]
K3  N168X_Key  [N168X_KEY]
K4  N168X_Key  [N168X_KEY]
K5  N168X_Key  [N168X_KEY]
K6  N168X_Key  [N168X_KEY]
K7  N168X_Key  [N168X_KEY]
K8  N168X_Key  [N168X_KEY]
K9  N168X_Key  [N168X_KEY]
K10  N168X_Key  [N168X_KEY]
K11  N168X_Key  [N168X_KEY]
K12  N168X_Key  [N168X_KEY]
K13  N168X_Key  [N168X_KEY]
K14  N168X_Key  [N168X_KEY]
K15  N168X_Key  [N168X_KEY]
K16  N168X_Key  [N168X_KEY]
K17  N168X_Key  [N168X_KEY]
K18  N168X_Key  [N168X_KEY]
K19  N168X_Key  [N168X_KEY]
K20  N168X_Key  [N168X_KEY]
K21  N168X_Key  [N168X_KEY]
LED1  TZ-P2-0603WYS1-1.1T  [LED-SMD_L1.6-W1.2-RD]
LED2  TZ-P2-0603WYS1-1.1T  [LED-SMD_L1.6-W1.2-RD]
Q2  HSST3139  [SOT-523-3_L1.6-W0.8-P1.00-LS1.6-BR]
R20  1kΩ  [R0603]
U8  PCA9555RGERG4  [VQFN-24_L4.0-W4.0-P0.50-TL-EP2.4]
sheet Power
BAT1  N68_BATJ  [N68_BATJ]
C1  100nF  [C0402_NEW]
C2  10uF  [C0402]
C3  47nF  [C0402]
C20  1uF  [C0402]
C34  1uF  [C0402]
C122  4.7uF  [C0402]
C134  10uF  [C0402]
C135  22uF  [C0603]
C136  22uF  [C0603]
D1  1N5819WS  [SOD-323_L1.8-W1.3-LS2.5-RD]
L4  1uH  [IND-SMD_L2.5-W2.0_252012]
R7  33kΩ  [R0402]
R18  33kΩ  [R0402]
U32  BQ25890RTWR  [WQFN-24_L4.0-W4.0-P0.50-BL-EP]
U39  MAX17048G+T10  [DFN-8_L2.0-W2.0-P0.50-BL-EP]
U41  SHTC3  [SENSORM-SMD_4P-L2.0-W2.0-P1.00]
sheet RF_GNSS
ANT2  GPS1003  [ANT-SMD_L10.0-W3.0]
C33  47pF  [C0402]
C41  2.7pF  [C0402]
C43  1uF  [C0402]
C44  4.7uF  [C0402]
C45  2.2uF  [C0402]
C46  1uF  [C0402]
C47  1uF  [C0402]
C48  1uF  [C0402]
C49  4.7uF  [C0402]
C50  1uF  [C0402]
L1  8.2nH  [IND-SMD_L1.0-W0.5-2]
L3  2.2uH  [L0806]
Q6  TP  [TP]
U18  UBX-G7020-KT  [UBX-G7020-KT]
X2  26MHz  [OSC-SMD_4P-L3.2-W2.5-BL_1XTV]
sheet RF_Sub1G
C12  100nF  [C0402_NEW]
C13  10uF  [C0402]
U64  HJ_LORA  [HJ_LORA]
sheet RTC
C40  100nF  [C0402_NEW]
C42  100nF  [C0402_NEW]
D3  1N5819WS  [SOD-323_L1.8-W1.3-LS2.5-RD]
U204  RX8900CE  [RX8130CE/RX8900CE]
sheet Storage
C8  100nF  [C0402_NEW]
C9  10uF  [C0402]
R4  33kΩ  [R0402]
RN2  33kΩ  [RES-ARRAY-SMD_0402-8P-L2.0-W1.0-BL]
U16  MKDV32GCL-STL  [W-PDFN-8_L8.0-W6.0-P1.27-TL-EP]
sheet USB
C10  100nF  [C0402_NEW]
C16  1uF  [C0402]
LED16  MHS110FRGBCT  [LED-ARRAY-SMD_MHS110FRGBCT]
U3  WD3153D-10/TR  [DFN-10_L2.0-W2.0-P0.40-BL-EP]
U135  FUSB301TMX  [TMLP-10_L1.6-W1.2-P0.40]
USB1  TYPE-611S-T3  [USB-SMD_TYPE-611S-T3]
sheet W1F1
ANT1  RFANT3216120A5T  [FILTER-SMD_1206-2P-L3.2-W1.6-L]
C71  4.7uF  [C0402]
C74  4.7uF  [C0402]
C75  4.7uF  [C0402]
L2  3.3uH  [L0805]
R10  33kΩ  [R0402]
R11  33kΩ  [R0402]
R29  33kΩ  [R0402]
R49  0Ω  [R0402]
R54  0Ω  [R0402]
RN1  33kΩ  [RES-ARRAY-SMD_0402-8P-L2.0-W1.0-BL]
U48  A_P6214  [AP6214A]

## Library data of the parts
C1 C4 C8 C10 C12 C14 C19 C38 C40 C42 = CL05B104KO5NNNC: Supplier: LCSC; Manufacturer: SAMSUNG; Supplier Part: C1525; JLCPCB Part Class: Basic Part
C5-C7 C15 C16 C20-C23 C26-C28 C32 C34 C43 C46-C48 C50 = CL05A105KA5NQNC: Supplier: LCSC; Manufacturer: SAMSUNG; Supplier Part: C52923; JLCPCB Part Class: Basic Part
C24 C25 C35 C37 C44 C49 C59 C60 C62 C64-C66 C71 C74 C75 = CL05A475MP5NRNC: Supplier: LCSC; Manufacturer: SAMSUNG; Supplier Part: C23733; JLCPCB Part Class: Basic Part
C29 C36 = CL05B104KO5NNNC: Supplier: LCSC; Manufacturer: SAMSUNG; Supplier Part: C1525; Paste Type: base; Assembly Type: smtWeld
C30 = CL05B104KO5NNNC: Supplier: LCSC; Manufacturer: SAMSUNG; Supplier Part: C1525; Paste Type: base
C31 = 0402B102K500NT: Supplier: LCSC; Manufacturer: FH; Supplier Part: C1523; JLCPCB Part Class: Basic Part
J1 J2 = N126x_EAR: Contributor: re1mu
MIC1 = WMM7037AT2: Supplier: LCSC; Manufacturer: WEIER; Contributor: LCSC; Supplier Part: C140705; JLCPCB Part Class: Extended Part
R14-R17 = 0402WGF2002TCE: Supplier: LCSC; Manufacturer: UniOhm; Supplier Part: C25765; Resistance (Ohms): 20K; JLCPCB Part Class: Basic Part
R19 = 0402WGF3301TCE: Supplier: LCSC; Manufacturer: UniOhm; Supplier Part: C25890; JLCPCB Part Class: Basic Part
U128 = NAU88C22YG: Supplier: LCSC; Manufacturer: NUVOTON; Supplier Part: C100123; JLCPCB Part Class: Extended Part
U129 U130 = BCT8890ELA-TR: Supplier: LCSC; Supplier Part: C2924400; Manufacturer: BROADCHIP(广芯电子); Contributor: LCSC
U140 = YMU762: Contributor: re1mu
U2 U8 U141 = PCA9555RGERG4: Supplier: LCSC; Supplier Part: C2669780; Manufacturer: TI(德州仪器); Contributor: LCSC; JLCPCB Part Class: Extended Part
X1 = OT201624MJBA4SL: Supplier: LCSC; Supplier Part: C725986; Manufacturer: YXC扬兴科技; Contributor: LCSC; JLCPCB Part Class: Extended Part
CONN1 = FH34SRJ-24S-0.5SH(50): Supplier: LCSC; Supplier Part: C324726; Manufacturer: Hirose; Contributor: LCSC; JLCPCB Part Class: Extended Part
U33 = VRD1528MTX: Supplier: LCSC; Supplier Part: C697914; Manufacturer: AnaSem; Contributor: LCSC; JLCPCB Part Class: Extended Part
C11 C18 = CL21A476MQYNNNE: Supplier: LCSC; Manufacturer: SAMSUNG; Supplier Part: C16780; JLCPCB Part Class: Basic Part
FPC1 = FH34SRJ-12S-0.5SH(50): Supplier: LCSC; Supplier Part: C424659; Manufacturer: Hirose; Contributor: LCSC; JLCPCB Part Class: Extended Part
Q3-Q6 = TP: Contributor: Nail3513
R1 R2 R12 R13 = 0402WGF2201TCE: Supplier: LCSC; Manufacturer: UniOhm; Supplier Part: C25879; SMT Type: Basic; JLCPCB SMD: Yes; JLCPCB Part Class: Basic Part
R3 R4 R7 R8 R10 R11 R18 R29 = 0402WGF3302TCE: Supplier: LCSC; Manufacturer: UniOhm; Supplier Part: C25779; Resistance (Ohms): 33K; JLCPCB Part Class: Basic Part
RN1-RN3 = WA04X333JTL: Supplier: LCSC; Supplier Part: C431861; Manufacturer: Walsin Tech Corp; Resistance (Ohms): 33K; Contributor: LCSC; JLCPCB Part Class: Extended Part
SW1 = 1TS026A-1800-0553-CT: Supplier: LCSC; Supplier Part: C913786; Manufacturer: HYP(鸿源精密); Contributor: LCSC; JLCPCB Part Class: Extended Part
U1 = X1000_Nano: Manufacturer: SudoMaker; Contributor: re1mu
J17 = JW_S-5012-A: link: https://item.taobao.com/item.htm?spm=a1z0d.6639537.1997196601.22.a8287484Rim0Ks&id=522601282751; Contributor: re1mu
Q1 Q2 = HSST3139: Supplier: LCSC; Supplier Part: C700948; Manufacturer: HUASHUO(华朔); Contributor: LCSC; JLCPCB Part Class: Extended Part
C2 C9 C13 C39 = CL05A106MQ5NUNC: Supplier: LCSC; Manufacturer: SAMSUNG; Supplier Part: C15525; JLCPCB Part Class: Basic Part
K1-K21 = N168X_Key: Contributor: re1mu
LED1 LED2 = TZ-P2-0603WYS1-1.1T: Supplier: LCSC; Supplier Part: C916072; Manufacturer: TUOZHAN; Contributor: LCSC; JLCPCB Part Class: Extended Part
R20 = 0603WAF1001T5E: Supplier: LCSC; Manufacturer: UniOhm; Supplier Part: C21190; Resistance (Ohms): 1K; JLCPCB Part Class: Basic Part
BAT1 = N68_BATJ: Contributor: SudoMaker
C3 = 0402B473K250CT: Supplier: LCSC; Supplier Part: C314287; Manufacturer: Walsin Tech Corp; Contributor: LCSC; JLCPCB Part Class: Extended Part
C122 = CL05A475MP5NRNC: Supplier: LCSC; Manufacturer: SAMSUNG; LCSC Assembly: Yes; Supplier Part: C23733; SMT Type: Basic; JLCPCB Part Class: Basic Part
C134 = CL05A106MQ5NUNC: Supplier: LCSC; Manufacturer: SAMSUNG; Supplier Part: C15525; Paste Type: base
C135 C136 = CL10A226MQ8NRNC: Supplier: LCSC; Manufacturer: SAMSUNG; LCSC Assembly: Yes; Supplier Part: C59461; SMT Type: Basic
D1 D3 = 1N5819WS: Supplier: LCSC; Supplier Part: C191023; Manufacturer: Guangdong Hottech; Contributor: LCSC; JLCPCB Part Class: Basic Part
L4 = HHEI252010A-1R0M-Q8: Supplier: LCSC; Supplier Part: C910025; Manufacturer: chilisin(奇力新); Contributor: LCSC; JLCPCB Part Class: Extended Part
U32 = BQ25890RTWR: Supplier: LCSC; Manufacturer: TI; Supplier Part: C130451; JLCPCB Part Class: Extended Part
U39 = MAX17048G+T10: Supplier: LCSC; Supplier Part: C2682616; Manufacturer: MAXIM(美信); JLCPCB Part Class: Extended Part; Contributor: LCSC
U41 = SHTC3: Supplier: LCSC; Supplier Part: C194656; Manufacturer: Sensirion; Contributor: LCSC; JLCPCB Part Class: Extended Part
ANT2 = GPS1003: Supplier: LCSC; Supplier Part: C239243; Manufacturer: Rainsun microwave Tech; Contributor: LCSC; JLCPCB Part Class: Extended Part
C33 = 0402CG470J500NT: Supplier: LCSC; Manufacturer: FH; Supplier Part: C1567; JLCPCB Part Class: Basic Part
C41 = 0402CG2R7C500NT: Supplier: LCSC; Manufacturer: FH; Supplier Part: C1561; JLCPCB Part Class: Basic Part
C45 = CL05A225MQ5NSNC: Supplier: LCSC; Manufacturer: SAMSUNG; Supplier Part: C12530; JLCPCB Part Class: Basic Part
L1 = LQW15AN8N2G00D: Supplier: LCSC; Manufacturer: MuRata; Supplier Part: C84404; JLCPCB Part Class: Extended Part
L3 = LQM2MPN2R2NG0L: Supplier: LCSC; Manufacturer: MuRata; Supplier Part: C83998; JLCPCB Part Class: Extended Part
U18 = UBX-G7020-KT: Contributor: SudoMaker
X2 = 1XTW26000MAA: Supplier: LCSC; Supplier Part: C213404; Manufacturer: KDS Daishinku; Contributor: LCSC; JLCPCB Part Class: Extended Part
U64 = HJ_LORA: Contributor: re1mu
U204 = RX8900CE: Manufacturer: EPSON; Contributor: SudoMaker
U16 = MKDV32GCL-STL: Supplier: LCSC; Supplier Part: C2844071; Manufacturer: MK(米客方德); JLCPCB Part Class: Extended Part; Contributor: LCSC
LED16 = MHS110FRGBCT: Supplier: LCSC; Supplier Part: C496820; Manufacturer: MEIHUA(美华科技); Contributor: LCSC; JLCPCB Part Class: Extended Part
U3 = WD3153D-10/TR: Supplier: LCSC; Supplier Part: C506151; Manufacturer: WILLSEMI(韦尔); Contributor: LCSC; JLCPCB Part Class: Extended Part
U135 = FUSB301TMX: Supplier: LCSC; Manufacturer: ON; Contributor: LCSC; Supplier Part: C132290; Paste Type: Extended Part; JLCPCB Part Class: Extended Part
USB1 = TYPE-611S-T3: Supplier: LCSC; Supplier Part: C2874595; Manufacturer: Yuandi(台湾元迪); Contributor: LCSC; JLCPCB Part Class: Extended Part
ANT1 = RFANT3216120A5T: Supplier: LCSC; Supplier Part: C127629; Manufacturer: Walsin Tech Corp; Frequency: 2450 MHz; Contributor: LCSC; JLCPCB Part Class: Extended Part
L2 = MPL2012S3R3MHT: Supplier: LCSC; Manufacturer: Sunlord; Supplier Part: C98331; JLCPCB Part Class: Extended Part
R49 R54 = 0402WGF0000TCE: Supplier: LCSC; Manufacturer: UniOhm; Supplier Part: C17168; Resistance (Ohms): 0; JLCPCB Part Class: Basic Part
U48 = A_P6214: 1ST PART DESCRIPTION: AMPEK WiFi+BT+FM AP6212; ORCAD_LIB: MODULE; QVL: AMPAK; Device: AMPAK_SIP; Contributor: SudoMaker

## Nets
3V3: C1.2 C8.2 C9.2 C10.2 C11.2 C12.2 C13.2 C14.2 C15.2 C16.1 C19.2 C29.2 C36.2 C38.2 C42.2 C46.1 C47.1 C49.1 C59.2 C64.2 C65.2 C66.2 C74.2 C75.1 CONN1.11 J17.11(IOVCC1.8) J17.12(IOVCC1.8) J17.13(VCC2.8) J17.14(VCC2.8) LED16.1(+) Q1.2(S) Q2.2(S) R1.2 R2.2 R3.2 R4.2 R12.2 R13.2 R29.2 RN1.5 RN1.6 RN1.7 RN1.8 RN2.5 RN2.6 RN2.7 RN2.8 RN3.5 RN3.6 RN3.7 RN3.8 U1.47(3V3) U2.21(VCC) U2.23(A1) U3.5(VCC) U8.21(VCC) U16.8(VDD) U18.6(V_BAKP) U18.7(VDD_IO) U18.21(V_DCDC_IN) U33.1(EN1) U33.2(VIN) U33.3(EN2) U41.1(VCC) U48.30(VDDIO) U48.33(VBAT) U64.2(VCC) U64.5(VCC) U128.13(VDDC) U128.14(VDDB) U128.26(VDDSPK) U128.31(VDDA) U135.5(VDD) U140.7(VDD) U140.32(IOVDD) U141.18(A0) U141.21(VCC) U204.2(VDD) X1.4(VDD)
GND: BAT1.1(BAT-) BAT1.4(SHELL) BAT1.5(SHELL) BAT1.6(SHELL) BAT1.7(SHELL) C1.1 C2.2 C4.1 C6.2 C8.1 C9.1 C10.1 C11.1 C12.1 C13.1 C14.1 C15.1 C16.2 C18.1 C19.1 C20.1 C21.1 C23.2 C24.1 C25.1 C27.1 C28.1 C29.1 C30.1 C31.2 C32.1 C34.1 C36.1 C38.1 C39.1 C40.1 C41.1 C42.1 C43.2 C44.2 C45.1 C46.2 C47.2 C48.2 C49.2 C50.2 C59.1 C60.1 C62.1 C64.1 C65.1 C66.1 C71.2 C74.1 C75.2 C122.2 C134.1 C135.2 C136.2 CONN1.2 CONN1.15 CONN1.24 CONN1.25 CONN1.26 FPC1.1 FPC1.9 FPC1.13 FPC1.14 J17.1(LEDK) J17.2(LEDK) J17.3(GND) J17.4(GND) J17.15(GND) J17.16(GND) K1.1 K2.1 K3.1 K4.1 K5.1 K6.1 K7.1 K8.1 K9.1 K10.1 K11.1 K12.1 K13.1 K14.1 K15.1 K16.1 K17.1 K18.1 K19.1 K20.1 K21.1 LED1.1(K) LED2.1(K) MIC1.2(GND) MIC1.3(GND) Q5.1 R10.1 R18.2 SW1.1 SW1.2 U1.1(GND) U1.17(GND) U1.48(GND) U1.82(GND) U1.89(GND) U1.103(GND) U1.104(GND) U1.105(GND) U1.106(GND) U1.107(GND) U1.108(GND) U1.109(GND) U1.116(GND) U1.125(GND) U1.126(GND) U2.9(GND) U2.18(A0) U2.24(A2) U2.25(EP) U3.7(SET) U3.11(GND) U8.9(GND) U8.18(A0) U8.23(A1) U8.24(A2) U8.25(EP) U16.4(GND) U16.9(EP) U18.9(VDD_USB) U18.12(RTC_XI) U18.26(PIO4) U18.27(PIO2) U18.28(PIO1) U18.29(PIO5) U18.41(GND) U32.10(ILIM) U32.17(PGND) U32.18(PGND) U32.25(PAD) U33.5(VSS) U39.1(CTG) U39.4(GND) U39.6(QSTRT) U39.9(EP) U41.4(VSS) U41.5(ep) U48.2(GND) U48.9(GND1) U48.14(GND2) U48.21(GND3) U48.29(GND4) U48.35(GND5) U48.44(GND6) U64.1(GND) U64.3(GND) U64.4(GND) U64.16(GND) U64.17(EP) U128.12(VSSD) U128.18(MODE) U128.24(VSSSPK) U128.28(VSSA) U128.33(EP) U129.7(GND) U129.9(EP) U130.7(GND) U130.9(EP) U135.4(GND) U140.8(VSS) U140.16(SPVSS) U141.9(GND) U141.23(A1) U141.24(A2) U141.25(EP) U204.1(FOE) U204.9(GND) USB1.1(SHELL) USB1.2(SHELL) USB1.3(SHELL) USB1.4(SHELL) USB1.A1B12(GND) USB1.B1A12(GND) X1.2(GND) X2.2(GND)
VBUS: C20.2 R8.2 U32.1(VBUS) U135.8(VBUS) USB1.A4B9(VBUS) USB1.B4A9(VBUS)
VDD_RTC_BAT: C40.2 D3.1(C) U204.3(VBAT)
BAT+: BAT1.3(BAT+) C34.2 C134.2 D3.2(A) U32.13(BAT) U32.14(BAT) U39.2(CELL) U39.3(VDD)
CAM_AVDD_2V8: C28.2 CONN1.4 CONN1.23 U33.4(VOUT2)
CAM_DVDD_1V5: C32.2 CONN1.10 U33.6(VOUT1)
CAM_PWDN: CONN1.8 U1.14(PA07_SLCD_D7)
CAM_RST: CONN1.6 U1.6(PA06_SLCD_D6)
CIM_D2_D0: CONN1.19 U1.20(PA19_CIM_D0)
CIM_D3_D1: CONN1.21 U1.24(PA18_CIM_D1)
CIM_D4_D2: CONN1.22 U1.21(PA17_CIM_D2)
CIM_D5_D3: CONN1.20 U1.19(PA16_CIM_D3)
CIM_D6_D4: CONN1.18 U1.23(PA15_CIM_D4)
CIM_D7_D5: CONN1.16 U1.22(PA14_CIM_D5)
CIM_D8_D6: CONN1.14 U1.25(PA13_CIM_D6)
CIM_D9_D7: CONN1.12 U1.18(PA12_CIM_D7)
CIM_HSYN: CONN1.9 U1.27(PA09_CIM_HSYN)
CIM_MCLK: CONN1.13 U1.29(PA11_CIM_MCLK)
CIM_PCLK: CONN1.17 U1.26(PA08_CIM_PCLK)
CIM_VSYN: CONN1.7 U1.28(PA10_CIM_VSYN)
CLK_32k: R11.1 U1.127(PB26_RTC32K)
CLK_12288: U140.1(CLKI) X1.3(OUT)
CODEC_AUXIN_L: C37.1 U128.19(LAUXIN)
CODEC_AUXIN_R: C35.1 U128.20(RAUXIN)
CODEC_AUXOUT_L: C22.2 U128.22(AUXOUT2)
CODEC_AUXOUT_R: C26.2 U128.21(AUXOUT1)
CODEC_HP_L: U128.30(LHP)
CODEC_HP_R: U128.29(RHP)
CODEC_MICBIAS: C4.2 C60.2 MIC1.1(VDD) U128.32(MICBIAS)
CODEC_MICLN: C23.1 U128.2(LMICN)
CODEC_MICLP: C5.1 U128.1(LMICP)
CODEC_MICRN: C6.1 U128.5(RMICN)
CODEC_MICRP: C7.2 U128.4(RMICP)
CODEC_VREF: C62.2 U128.27(VREF)
CPU_INT_FUSB301: U2.6(P05) U135.10(INT_N)
CPU_INT_GAUGE: U2.7(P06) U39.5(ALRT#)
CPU_INT_IOEXP_2: RN3.1 U1.44(PC20) U2.22(INT#)
CPU_INT_IOEXP_KP: RN3.3 U1.46(PC19) U8.22(INT#)
CPU_INT_IOEXP_Y762: RN3.2 U1.45(PC18) U141.22(INT#)
CPU_INT_PMIC: U2.11(P11) U32.7(INT)
CPU_INT_RTC: U2.12(P12) U204.10(/INT)
CPU_RESET#: FPC1.12 SW1.3 SW1.4 U1.78(PPRST#)
CPU_TCK: FPC1.7 U1.121(TCK)
CPU_TDI: FPC1.4 U1.59(TDI_UART2_RX)
CPU_TDO: FPC1.5 U1.60(TDO_UART2_TX)
CPU_TMS: FPC1.6 U1.120(TMS)
CPU_TRST: FPC1.8 U1.113(TRST)
CPU_WKUP#: D1.2(A) U1.79(PB31_WKUP#)
EAR_1: J1.1 J1.2 U130.8(OUT-)
EAR_2: J2.1 J2.2 R16.1 U130.5(OUT+)
EXCLK: U1.118(PB27_EXCLK)
GNSS_1PPS: U1.124(PB12_MAC_TXD0) U18.35(PIO11)
GNSS_ANT: ANT2.1 C33.1
GNSS_BOOT0: Q6.1 U18.34(PIO12)
GNSS_PWR: U1.123(PB13_MAC_MDC) U18.14(PIO13)
GNSS_RST#: U1.122(PB15_MAC_REFCLK) U18.17(RESET_N)
I2C0_SCL: R13.1 U1.119(PB23_I2C0_SCL) U2.19(SCL) U8.19(SCL) U32.5(SCL) U39.7(SCL) U41.2(SCL) U128.16(SCLK) U141.19(SCL) U204.5(SCL)
I2C0_SDA: R12.1 U1.110(PB24_I2C0_SDA) U2.20(SDA) U8.20(SDA) U32.6(SDA) U39.8(SDA) U41.3(SDA) U128.17(SDIO) U141.20(SDA) U204.7(SDA)
I2C1_SCL: CONN1.5 R1.1 U1.5(PA00_SLCD_D0) U3.10(SCL) U18.31(PIO8) U135.2(SCL)
I2C1_SDA: CONN1.3 R2.1 U1.2(PA01_SLCD_D1) U3.9(SDA) U18.32(PIO9) U135.1(SDA)
I2S0_FS: U1.49(PC09_PCM_SYN) U48.37(PCM_SYNC)
I2S0_MISO: U1.51(PC08_PCM_DI) U48.38(PCM_OUT)
I2S0_MOSI: U1.50(PC07_PCM_DO) U48.39(PCM_IN)
I2S0_SCK: U1.52(PC06_PCM_CLK) U48.36(PCM_CLK)
I2S1_CS: U1.76(PB02_I2S_LRCK) U128.7(FS)
I2S1_MCLK: U1.72(PB00_I2S_MCLK) U128.11(MCLK)
I2S1_MISO: U1.73(PB03_I2S_DI) U128.9(ADCOUT)
I2S1_MOSI: U1.75(PB04_I2S_DO) U128.10(DACIN)
I2S1_SCLK: U1.74(PB01_I2S_BCLK) U128.8(BCLK)
KEY_0: K20.2 U8.16(P16)
KEY_1: K10.2 U8.8(P07)
KEY_2: K11.2 U8.6(P05)
KEY_3: K12.2 U8.5(P04)
KEY_4: K13.2 U8.11(P11)
KEY_5: K14.2 U8.10(P10)
KEY_6: K15.2 U8.7(P06)
KEY_7: K16.2 U8.14(P14)
KEY_8: K17.2 U8.13(P13)
KEY_9: K18.2 U8.12(P12)
KEY_#: K21.2 U8.15(P15)
KEY_*: K19.2 U8.17(P17)
KEY_CALL: K7.2 U2.16(P16)
KEY_CENTER: K5.2 U2.17(P17)
KEY_DOWN: K8.2 U8.4(P03)
KEY_HANGUP_PWR: D1.1(C) K9.2 U32.12(QON#)
KEY_LEFT: K4.2 U8.2(P01)
KEY_LF_BOOT0: FPC1.2 K1.2 RN3.4 U1.67(PB28_BOOTSEL_0)
KEY_RF_BOOT1: FPC1.3 K3.2 R3.1 U1.66(PB29_BOOTSEL_1)
KEY_RIGHT: K6.2 U8.3(P02)
KEY_UP: K2.2 U8.1(P00)
KP_LED+: C39.2 LED1.2(A) LED2.2(A) R20.1
LCD_D_C: J17.7(WR) U1.98(PB07_MAC_CRSDV)
LCD_LED+: C18.2 J17.23(LEDA) J17.24(LEDA) Q1.3(D)
LCD_RESET#: J17.10(RESET) U1.99(PB10_MAC_TXEN)
LCD_TE: J17.5(FMARK) U1.97(PB06_MAC_PHYCLK)
LED_B: LED16.2(-) U3.3(LED2)
LED_G: LED16.3(-) U3.2(LED1)
LED_R: LED16.4(-) U3.1(LED0)
Lora_0_ANT: U64.13(ANT)
Lora_0_BUSY: U1.42(PC17) U64.9(BUSY)
Lora_0_DIO1: U1.41(PC16) U64.8(DIO1)
Lora_0_DIO2: U1.40(PC22) U64.7(DIO2)
Lora_0_NRST: U1.43(PC23) U64.10(NRST)
PHONE_MIC: C5.2
PMIC_CE: U2.8(P07) U32.9(CE#)
PMIC_OTG: U2.10(P10) U32.8(OTG)
PMIC_SW: C3.2 L4.1 U32.19(SW) U32.20(SW)
PMIC_TS: R7.2 R18.1 U32.11(TS)
PSW_3V3_KPBL#: Q2.1(G) U1.64(PC25_PWM0)
PSW_3V3_LCDBL#: Q1.1(G) U1.65(PC24_PWM4)
PSW_AAMP_EARP: U2.13(P13) U130.1(SHDN)
PSW_AAMP_SPK: U2.14(P14) U129.1(SHDN)
SD_CLK: U1.34(PA24_MSC0_CLK) U16.3(CLK)
SD_CMD: R4.1 U1.35(PA25_MSC0_CMD) U16.5(CMD)
SD_D0: RN2.4 U1.33(PA23_MSC0_D0) U16.6(DAT0)
SD_D1: RN2.3 U1.32(PA22_MSC0_D1) U16.7(DAT1)
SD_D2: RN2.1 U1.31(PA21_MSC0_D2) U16.1(DAT2)
SD_D3: RN2.2 U1.30(PA20_MSC0_D3) U16.2(DAT3)
SDIO_WiFi_CLK: U1.56(PC00_MSC1_CLK) U48.24(SDIO_DATA_CLK)
SDIO_WiFi_CMD: R29.1 U1.58(PC01_MSC1_CMD) U48.23(SDIO_DATA_CMD)
SDIO_WiFi_D0: RN1.2 U1.57(PC02_MSC1_D0) U48.26(SDIO_DATA_0)
SDIO_WiFi_D1: RN1.4 U1.55(PC03_MSC1_D1) U48.28(SDIO_DATA_1)
SDIO_WiFi_D2: RN1.1 U1.53(PC04_MSC1_D2) U48.25(SDIO_DATA_2)
SDIO_WiFi_D3: RN1.3 U1.54(PC05_MSC1_D3) U48.27(SDIO_DATA_3)
SPIHW_CS: J17.9(CS) U1.70(PD01_SPI_CS_I2C2_SDA)
SPIHW_MISO: U1.68(PD03_SPI_MISO_UART1_TX)
SPIHW_MOSI: J17.6(SDA) U1.69(PD02_SPI_MOSI_UART1_RX)
SPIHW_SCLK: J17.8(SCL) U1.71(PD00_SPI_SCK_I2C2_SCL)
SPISW_CS_L0: U1.12(PB20_SLCD_D_C#) U64.15(NSS)
SPISW_MISO: U1.9(PB19_SLCD_TE) U64.11(MISO)
SPISW_MOSI: U1.8(PB18_SLCD_CS#) U64.14(MOSI)
SPISW_SCLK: U1.10(PB17_SLCD_WR#) U64.12(SCK)
SPK_1: U129.8(OUT-)
SPK_2: R14.1 U129.5(OUT+)
UART2_RX: FPC1.10 Q3.1 U1.111(PD05_UART2_RX_UART1_RTS)
UART2_TX: FPC1.11 Q4.1 U1.112(PD04_UART2_TX_UART1_CTS)
UART_BT_CTS_CPU_RTS: U1.38(PC13_UART0_RTS) U48.42(UART_CTS_N)
UART_BT_RTS_CPU_CTS: U1.39(PC12_UART0_CTS) U48.43(UART_RTS_N)
UART_BT_RX_CPU_TX: U1.37(PC11_UART0_TX) U48.41(UART_RXD)
UART_BT_TX_CPU_RX: U1.36(PC10_UART0_RX) U48.40(UART_TXD)
UART_GNSS_RX_CPU_TX: U1.13(PA05_SLCD_D5) U18.18(PIO7)
UART_GNSS_TX_CPU_RX: U1.11(PA04_SLCD_D4) U18.19(PIO6)
USB_CC1: U135.6(CC1) USB1.A5(CC1)
USB_CC2: U135.7(CC2) USB1.B5(CC2)
USB_D+: U1.86(USB_D+) USB1.A6(DP1) USB1.B6(DP2)
USB_D-: U1.85(USB_D-) USB1.A7(DN1) USB1.B7(DN2)
USB_ID: U1.88(USB_ID) U1.117(PC21) U135.3(ID)
USB_SBU1: USB1.A8(SBU1)
USB_SBU2: USB1.B8(SBU2)
VSYS: C24.2 C25.2 C135.1 C136.1 L4.2 U1.15(VSYS) U1.16(VSYS) U32.15(SYS) U32.16(SYS) U129.6(VCC) U130.6(VCC)
WiFi_ANT_PORT: R54.1 U48.1(WL_BT_ANT)
WiFi_VIN_LDO: C71.1 L2.1 U48.32(VIN_LDO)
WiFi_VIN_LDO_OUT: L2.2 U48.34(VIN_LDO_OUT)
WL_BT_REG_EN: U2.3(P02) U48.5(BT_REG_ON)
WL_BT_WAKE_HOST: U2.4(P03) U48.4(BT_HOST_WAKE)
WL_HOST_WAKE_BT: U2.5(P04) U48.3(BT_WAKE)
WL_REG_EN: U2.2(P01) U48.20(WL_REG_ON)
WL_WAKE_HOST: U2.1(P00) U48.19(WL_HOST_WAKE)
Y762_A0: U140.30(A0) U141.15(P15)
Y762_AOUT_L: C37.2 U140.10(HPOUT-L/MONO)
Y762_AOUT_R: C35.2 U140.11(HPOUT_R)
Y762_CLK_EN: U141.11(P11) X1.1(TRI)
Y762_CS#: U140.29(CS#) U141.16(P16)
Y762_D0: U140.27(D0) U141.1(P00)
Y762_D1: U140.26(D1) U141.2(P01)
Y762_D2: U140.25(D2) U141.3(P02)
Y762_D3: U140.24(D3) U141.4(P03)
Y762_D4: U140.23(D4) U141.5(P04)
Y762_D5: U140.22(D5) U141.6(P05)
Y762_D6: U140.21(D6) U141.7(P06)
Y762_D7: U140.20(D7) U141.8(P07)
Y762_IRQ#: U140.3(IRQ#) U141.13(P13)
Y762_LED: U140.2(LED)
Y762_MTR: U140.19(MTR)
Y762_PLLC: R19.1 U140.6(PLLC)
Y762_RD#: U140.31(RD#) U141.14(P14)
Y762_RST#: U140.4(RST#) U141.12(P12)
Y762_VREF: C30.2 U140.9(VREF)
Y762_WR#: U140.28(WR#) U141.17(P17)
C33_2: C33.2 C41.2 L1.1
C43_1: C43.1 U18.1(VDD_ANA) U18.38(LDO_RF_OUT) U18.39(VDD_LNA)
C44_1: C44.1 L3.1 U18.23(V_CORE)
C45_2: C45.2 U18.5(LDO_B_OUT)
C48_1: C48.1 U18.2(LDO_X_OUT) X2.1(OE#) X2.4(VDD)
C50_1: C50.1 U18.24(LDO_C_OUT)
C122_1: C122.1 R7.1 U32.22(REGN)
L1_2: L1.2 U18.40(LNA_IN)
L3_2: L3.2 U18.22(V_DCDC_OUT)
MIC1_4: C7.1 MIC1.4(OUT)
R8_1: R8.1 U1.87(USB_VBUS)
R15_1: C22.1 R15.1
R17_1: C26.1 R17.1
R19_2: C31.1 R19.2
R20_2: Q2.3(D) R20.2
R49_1: R49.1 R54.2
R49_2: ANT1.1 R49.2
U32_21: C3.1 U32.21(BTST)
U32_23: C2.1 U32.23(PMID)
U48_31: R10.2 R11.2 U48.31(LPO)
U129_2: C21.2 U129.2(BIAS) U129.3(IN+)
U129_4: R14.2 R15.2 U129.4(IN-)
U130_2: C27.2 U130.2(BIAS) U130.3(IN+)
U130_4: R16.2 R17.2 U130.4(IN-)
X2_3: U18.3(XTAL_I) X2.3(OUT)

Not connected (* = marked no-connect by the designer): ANT1 2*; ANT2 2*; BAT1 2(NTC)*; CONN1 1*; J17 17(NC)* 18(NC)* 19(NC)* 20(NC)* 21(NC)* 22(NC)*; U1 3(PB16_SLCD_RD#) 4(PA02_SLCD_D2) 7(PA03_SLCD_D3) 61(PB22_DMIC_IN0)* 62(PC27_I2C1_SDA_PWM2)* 63(PC26_I2C1_SCL_PWM1)* 77(CPU_FUSE)* 80(PB05_DMIC_IN1)* 81(PB21_DMIC_CLK)* 83(1V8)* 84(PB25_DRV_VBUS)* 90(CODEC_MICBIAS)* 91(CODEC_AIN_N)* 92(CODEC_AIN_P)* 93(CODEC_PWMLP)* 94(CODEC_PWMLN)* 95(CODEC_PWMRN)* 96(CODEC_PWMRP)* 100(PB09_MAC_RXD0) 101(PB08_MAC_RXD1) 102(PB14_MAC_MDIO) 114(2V5) 115(PB11_MAC_TXD1); U2 15(P15); U3 4(INTN)* 6(NC)* 8(CHRG)*; U18 4(XTAL_O)* 8(USB_DM)* 10(USB_P)* 11(RTC_XO)* 13(PIO14)* 15(TCK)* 16(TMS)* 20(T_SENSE)* 25(PIO0)* 30(PIO3)* 33(PIO10)* 36(PIO15)* 37(PIO16)*; U32 2(D+)* 3(D-)* 4(STAT)* 24(DSEL)*; U48 6(NC1)* 7(NC2)* 8(NC3)* 10(NC4)* 11(NC5)* 12(NC6)* 13(NC7)* 15(NC8)* 16(NC9)* 17(WL_GPIO2)* 18(WL_GPIO1)* 22(NC10)*; U64 6(DIO3)*; U128 3(LLIN/GPIO2)* 6(RLIN/GPIO3)* 15(CSB)* 23(RSPKOUT)* 25(LSPKOUT)*; U135 9(SS_SW)*; U140 5(NC)* 12(EQ1)* 13(EQ2)* 14(EQ3)* 15(SPVDD)* 17(SPOUT1)* 18(SPOUT2)*; U141 10(P10)*; U204 4(FOUT)* 6(T1)* 8(T2)*

## Notes on the sheets
sheet 1
- NAU88C22: 0x1a
- PCA9555: 0x20, 0x21, 0x22
- FUSB301TMX: 0x25
- RX8900CE: 0x32
- MAX17048: 0x36
- TS3A227E: 0x3b
- BQ25890: 0x6a
- SHTC3: 0x70
- LICENSE:
- CERN-OHL2-S
sheet 2
- LICENSE:
- CERN-OHL2-S
sheet 3
- I2C Addr: 0x25
- LICENSE:
- CERN-OHL2-S
sheet 4
- I2C Addr: 0x1a
- LICENSE:
- CERN-OHL2-S
sheet 5
- LICENSE:
- CERN-OHL2-S
sheet 6
- LICENSE:
- CERN-OHL2-S
sheet 7
- I2C Addr: 0x6a
- I2C Addr: 0x36
- LICENSE:
- CERN-OHL2-S
- I2C Addr: 0x70
sheet 8
- LICENSE:
- CERN-OHL2-S
sheet 9
- LICENSE:
- CERN-OHL2-S
sheet 10
- LICENSE:
- CERN-OHL2-S
sheet 11
- LICENSE:
- CERN-OHL2-S
sheet 12
- LICENSE:
- CERN-OHL2-S
